# Altium project RK3588.PrjPcb (part 3 of 3)

## Sheet 20.BTB.SchDoc
size A3; SheetNumber: 20; SheetTotal: 21
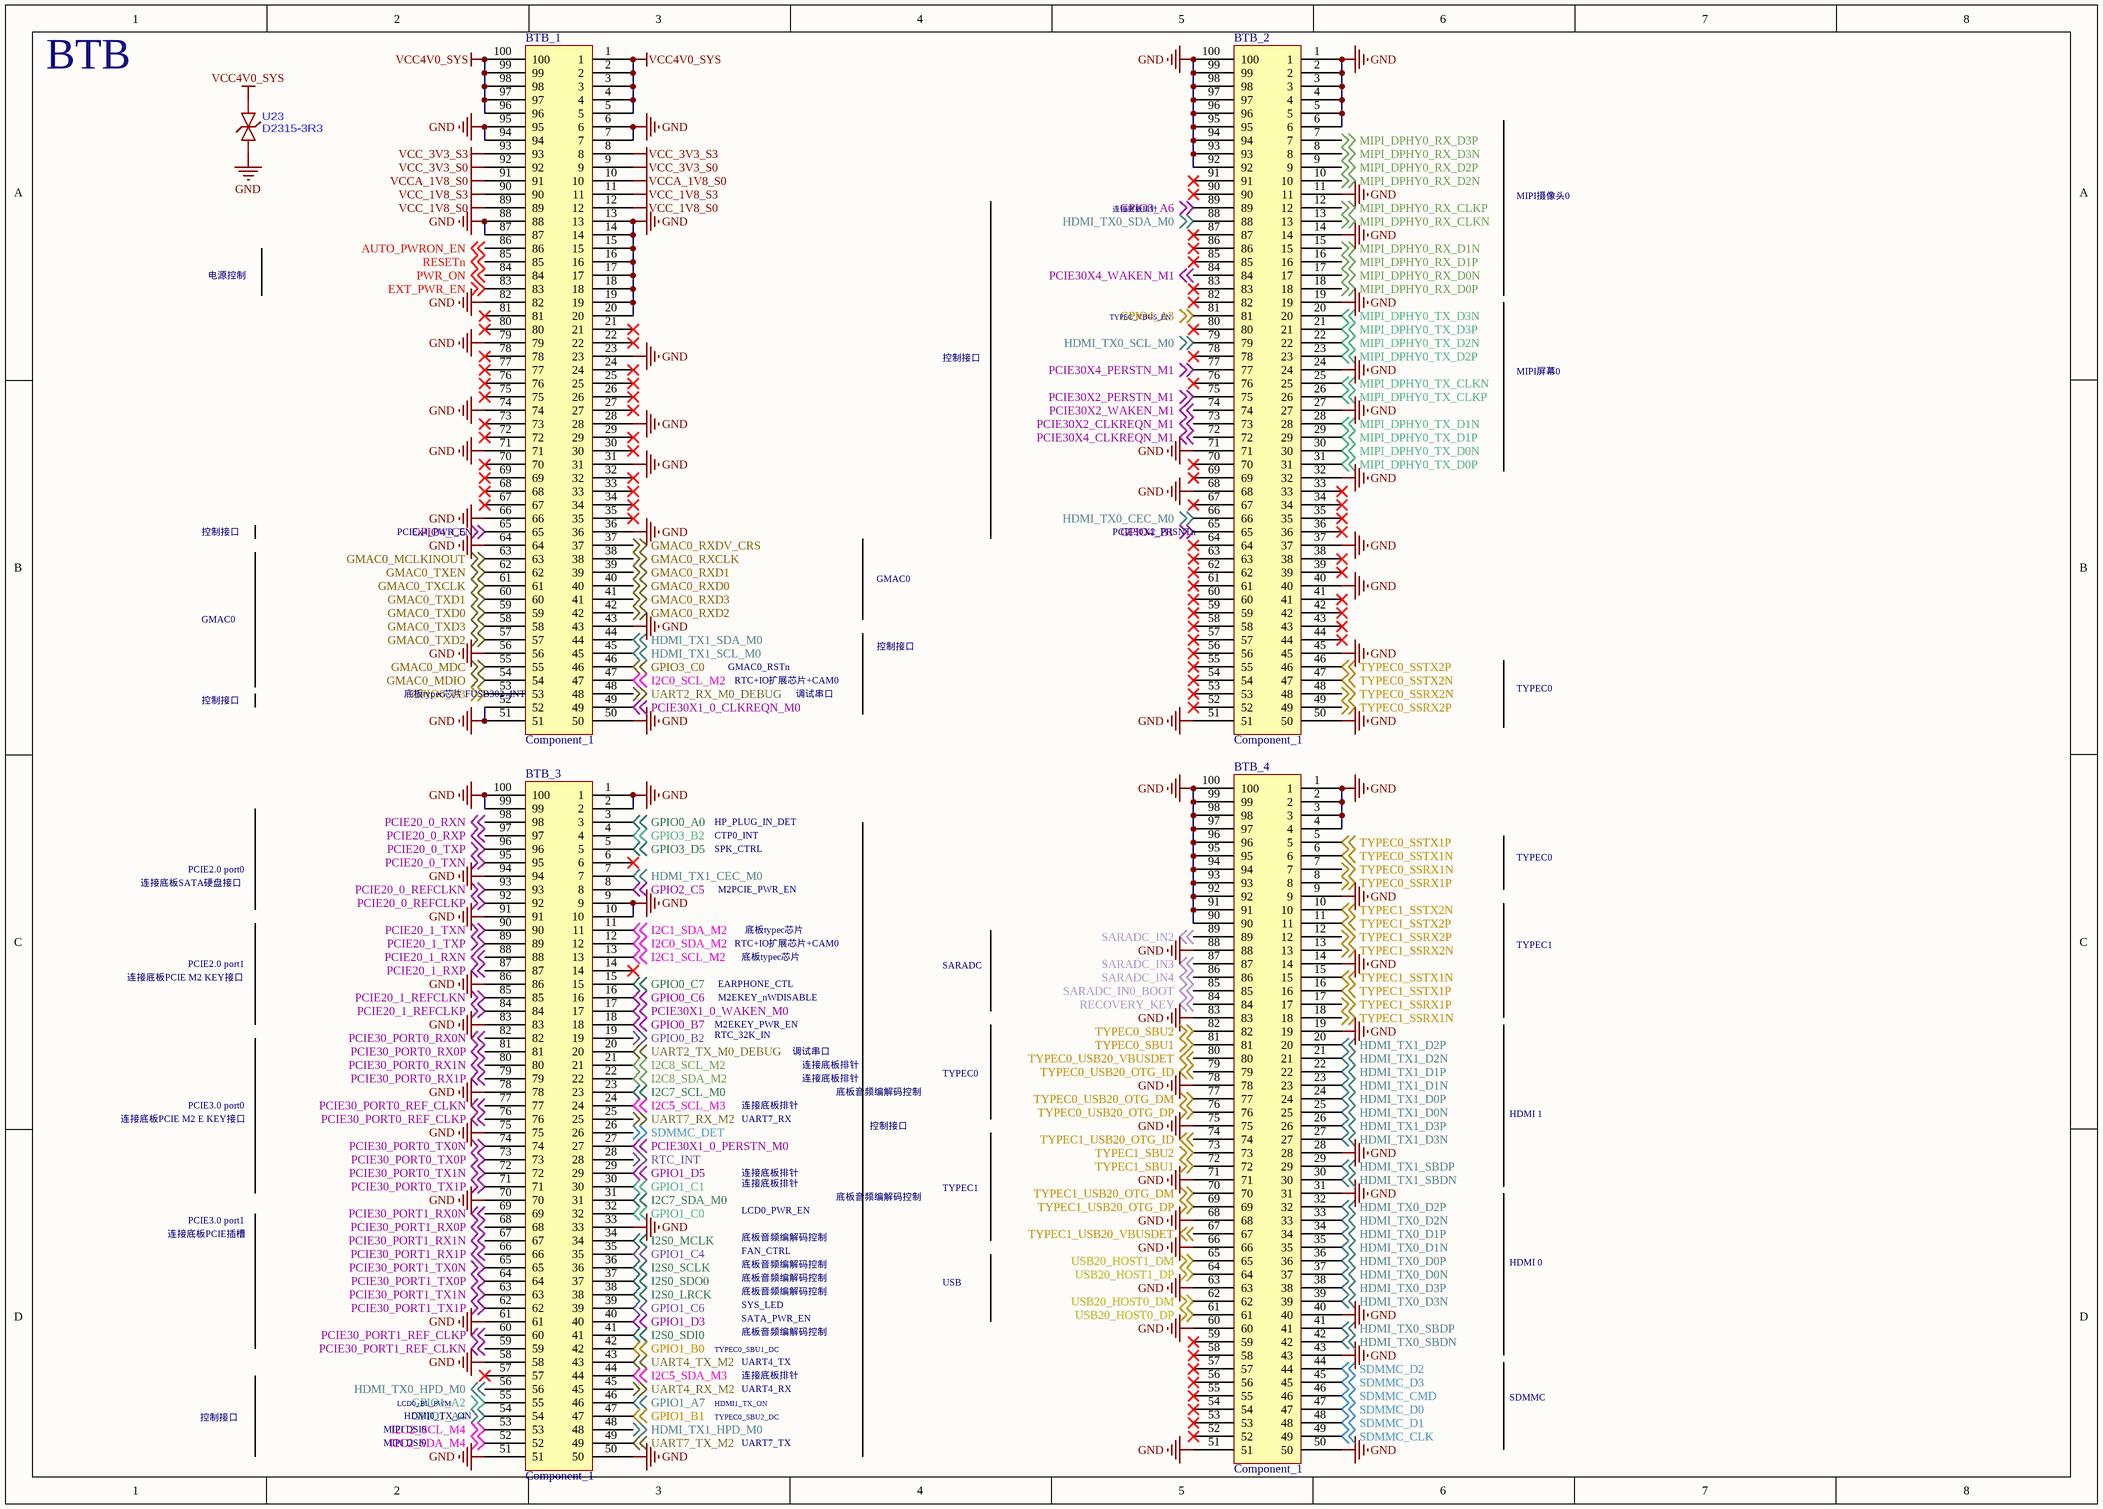
[diagram p19: 20.BTB.SchDoc]

### Parts
BTB_1  Component_1  [F_100PIN]
BTB_2  Component_1  [F_100PIN]
BTB_3  Component_1  [F_100PIN]
BTB_4  Component_1  [F_100PIN]
U23  D2315-3R3  [DFN1006-2L-BI]

### Nets
GND: BTB_1.6 BTB_1.7 BTB_1.13 BTB_1.14 BTB_1.15 BTB_1.16 BTB_1.17 BTB_1.18 BTB_1.19 BTB_1.20 BTB_1.23 BTB_1.28 BTB_1.31 BTB_1.36 BTB_1.43 BTB_1.50 BTB_1.51 BTB_1.52 BTB_1.56 BTB_1.64 BTB_1.66 BTB_1.71 BTB_1.74 BTB_1.79 BTB_1.82 BTB_1.87 BTB_1.88 BTB_1.94 BTB_1.95 BTB_2.1 BTB_2.2 BTB_2.3 BTB_2.4 BTB_2.5 BTB_2.6 BTB_2.11 BTB_2.14 BTB_2.19 BTB_2.24 BTB_2.27 BTB_2.32 BTB_2.37 BTB_2.40 BTB_2.45 BTB_2.50 BTB_2.51 BTB_2.68 BTB_2.71 BTB_2.92 BTB_2.93 BTB_2.94 BTB_2.95 BTB_2.96 BTB_2.97 BTB_2.98 BTB_2.99 BTB_2.100 BTB_3.1 BTB_3.2 BTB_3.9 BTB_3.10 BTB_3.33 BTB_3.50 BTB_3.51 BTB_3.58 BTB_3.61 BTB_3.70 BTB_3.75 BTB_3.78 BTB_3.83 BTB_3.86 BTB_3.91 BTB_3.94 BTB_3.99 BTB_3.100 BTB_4.1 BTB_4.2 BTB_4.3 BTB_4.4 BTB_4.9 BTB_4.14 BTB_4.19 BTB_4.28 BTB_4.31 BTB_4.40 BTB_4.43 BTB_4.50 BTB_4.51 BTB_4.60 BTB_4.63 BTB_4.66 BTB_4.68 BTB_4.71 BTB_4.75 BTB_4.78 BTB_4.83 BTB_4.88 BTB_4.90 BTB_4.91 BTB_4.92 BTB_4.93 BTB_4.94 BTB_4.95 BTB_4.96 BTB_4.97 BTB_4.98 BTB_4.99 BTB_4.100 U23.1
VCC4V0_SYS: BTB_1.1 BTB_1.2 BTB_1.3 BTB_1.4 BTB_1.5 BTB_1.96 BTB_1.97 BTB_1.98 BTB_1.99 BTB_1.100 U23.2
VCC_1V8_S0: BTB_1.12 BTB_1.89
VCC_1V8_S3: BTB_1.11 BTB_1.90  [project net VCC1V8_PMU_DDR_S3]
VCC_3V3_S0: BTB_1.9 BTB_1.92
VCC_3V3_S3: BTB_1.8 BTB_1.93
VCCA_1V8_S0: BTB_1.10 BTB_1.91  [project net AVDD1V8_DDR_PLL_S0]
AUTO_PWRON_EN: BTB_1.86 ; off-sheet AUTO_PWRON_EN
EXT_PWR_EN: BTB_1.83 ; off-sheet EXT_PWR_EN
GMAC0_MCLKINOUT: BTB_1.63 ; off-sheet GMAC0_MCLKINOUT
GMAC0_MDC: BTB_1.55 ; off-sheet GMAC0_MDC
GMAC0_MDIO: BTB_1.54 ; off-sheet GMAC0_MDIO
GMAC0_RXCLK: BTB_1.38 ; off-sheet GMAC0_RXCLK
GMAC0_RXD0: BTB_1.40 ; off-sheet GMAC0_RXD0
GMAC0_RXD1: BTB_1.39 ; off-sheet GMAC0_RXD1
GMAC0_RXD2: BTB_1.42 ; off-sheet GMAC0_RXD2
GMAC0_RXD3: BTB_1.41 ; off-sheet GMAC0_RXD3
GMAC0_RXDV_CRS: BTB_1.37 ; off-sheet GMAC0_RXDV_CRS
GMAC0_TXCLK: BTB_1.61 ; off-sheet GMAC0_TXCLK
GMAC0_TXD0: BTB_1.59 ; off-sheet GMAC0_TXD0
GMAC0_TXD1: BTB_1.60 ; off-sheet GMAC0_TXD1
GMAC0_TXD2: BTB_1.57 ; off-sheet GMAC0_TXD2
GMAC0_TXD3: BTB_1.58 ; off-sheet GMAC0_TXD3
GMAC0_TXEN: BTB_1.62 ; off-sheet GMAC0_TXEN
GPIO0_A0: BTB_3.3 ; off-sheet GPIO0_A0
GPIO0_B2: BTB_3.19 ; off-sheet GPIO0_B2
GPIO0_B7: BTB_3.18 ; off-sheet GPIO0_B7
GPIO0_C6: BTB_3.16 ; off-sheet GPIO0_C6
GPIO0_C7: BTB_3.15 ; off-sheet GPIO0_C7
GPIO0_D3: BTB_1.53 ; off-sheet GPIO0_D3
GPIO1_A2: BTB_3.55 ; off-sheet GPIO1_A2
GPIO1_A4: BTB_3.54 ; off-sheet GPIO1_A4
GPIO1_A7: BTB_3.46 ; off-sheet GPIO1_A7
GPIO1_B0: BTB_3.42 ; off-sheet GPIO1_B0
GPIO1_B1: BTB_3.47 ; off-sheet GPIO1_B1
GPIO1_C0: BTB_3.32 ; off-sheet GPIO1_C0
GPIO1_C1: BTB_3.30 ; off-sheet GPIO1_C1
GPIO1_C4: BTB_3.35 ; off-sheet GPIO1_C4
GPIO1_C6: BTB_3.39 ; off-sheet GPIO1_C6
GPIO1_D3: BTB_3.40 ; off-sheet GPIO1_D3
GPIO1_D5: BTB_3.29 ; off-sheet GPIO1_D5
GPIO2_C5: BTB_3.8 ; off-sheet GPIO2_C5
GPIO3_A6: BTB_2.89 ; off-sheet GPIO3_A6
GPIO3_B2: BTB_3.4 ; off-sheet GPIO3_B2
GPIO3_C0: BTB_1.46 ; off-sheet GPIO3_C0
GPIO3_D5: BTB_3.5 ; off-sheet GPIO3_D5
GPIO4_A3: BTB_2.81 ; off-sheet GPIO4_A3
GPIO4_B1: BTB_2.65 ; off-sheet GPIO4_B1
GPIO4_C6: BTB_1.65 ; off-sheet GPIO4_C6
HDMI_TX0_CEC_M0: BTB_2.66 ; off-sheet HDMI_TX0_CEC_M0
HDMI_TX0_D0N: BTB_4.37 ; off-sheet HDMI_TX0_D0N
HDMI_TX0_D0P: BTB_4.36 ; off-sheet HDMI_TX0_D0P
HDMI_TX0_D1N: BTB_4.35 ; off-sheet HDMI_TX0_D1N
HDMI_TX0_D1P: BTB_4.34 ; off-sheet HDMI_TX0_D1P
HDMI_TX0_D2N: BTB_4.33 ; off-sheet HDMI_TX0_D2N
HDMI_TX0_D2P: BTB_4.32 ; off-sheet HDMI_TX0_D2P
HDMI_TX0_D3N: BTB_4.39 ; off-sheet HDMI_TX0_D3N
HDMI_TX0_D3P: BTB_4.38 ; off-sheet HDMI_TX0_D3P
HDMI_TX0_HPD_M0: BTB_3.56 ; off-sheet HDMI_TX0_HPD_M0
HDMI_TX0_SBDN: BTB_4.42 ; off-sheet HDMI_TX0_SBDN
HDMI_TX0_SBDP: BTB_4.41 ; off-sheet HDMI_TX0_SBDP
HDMI_TX0_SCL_M0: BTB_2.79 ; off-sheet HDMI_TX0_SCL_M0
HDMI_TX0_SDA_M0: BTB_2.88 ; off-sheet HDMI_TX0_SDA_M0
HDMI_TX1_CEC_M0: BTB_3.7 ; off-sheet HDMI_TX1_CEC_M0
HDMI_TX1_D0N: BTB_4.25 ; off-sheet HDMI_TX1_D0N
HDMI_TX1_D0P: BTB_4.24 ; off-sheet HDMI_TX1_D0P
HDMI_TX1_D1N: BTB_4.23 ; off-sheet HDMI_TX1_D1N
HDMI_TX1_D1P: BTB_4.22 ; off-sheet HDMI_TX1_D1P
HDMI_TX1_D2N: BTB_4.21 ; off-sheet HDMI_TX1_D2N
HDMI_TX1_D2P: BTB_4.20 ; off-sheet HDMI_TX1_D2P
HDMI_TX1_D3N: BTB_4.27 ; off-sheet HDMI_TX1_D3N
HDMI_TX1_D3P: BTB_4.26 ; off-sheet HDMI_TX1_D3P
HDMI_TX1_HPD_M0: BTB_3.48 ; off-sheet HDMI_TX1_HPD_M0
HDMI_TX1_SBDN: BTB_4.30 ; off-sheet HDMI_TX1_SBDN
HDMI_TX1_SBDP: BTB_4.29 ; off-sheet HDMI_TX1_SBDP
HDMI_TX1_SCL_M0: BTB_1.45 ; off-sheet HDMI_TX1_SCL_M0
HDMI_TX1_SDA_M0: BTB_1.44 ; off-sheet HDMI_TX1_SDA_M0
I2C0_SCL_M2: BTB_1.47 ; off-sheet I2C0_SCL_M2
I2C0_SDA_M2: BTB_3.12 ; off-sheet I2C0_SDA_M2
I2C1_SCL_M2: BTB_3.13 ; off-sheet I2C1_SCL_M2
I2C1_SDA_M2: BTB_3.11 ; off-sheet I2C1_SDA_M2
I2C2_SCL_M4: BTB_3.53 ; off-sheet I2C2_SCL_M4
I2C2_SDA_M4: BTB_3.52 ; off-sheet I2C2_SDA_M4
I2C5_SCL_M3: BTB_3.24 ; off-sheet I2C5_SCL_M3
I2C5_SDA_M3: BTB_3.44 ; off-sheet I2C5_SDA_M3
I2C7_SCL_M0: BTB_3.23 ; off-sheet I2C7_SCL_M0
I2C7_SDA_M0: BTB_3.31 ; off-sheet I2C7_SDA_M0
I2C8_SCL_M2: BTB_3.21 ; off-sheet I2C8_SCL_M2
I2C8_SDA_M2: BTB_3.22 ; off-sheet I2C8_SDA_M2
I2S0_LRCK: BTB_3.38 ; off-sheet I2S0_LRCK
I2S0_MCLK: BTB_3.34 ; off-sheet I2S0_MCLK
I2S0_SCLK: BTB_3.36 ; off-sheet I2S0_SCLK
I2S0_SDI0: BTB_3.41 ; off-sheet I2S0_SDI0
I2S0_SDO0: BTB_3.37 ; off-sheet I2S0_SDO0
MIPI_DPHY0_RX_CLKN: BTB_2.13 ; off-sheet MIPI_DPHY0_RX_CLKN
MIPI_DPHY0_RX_CLKP: BTB_2.12 ; off-sheet MIPI_DPHY0_RX_CLKP
MIPI_DPHY0_RX_D0N: BTB_2.17 ; off-sheet MIPI_DPHY0_RX_D0N
MIPI_DPHY0_RX_D0P: BTB_2.18 ; off-sheet MIPI_DPHY0_RX_D0P
MIPI_DPHY0_RX_D1N: BTB_2.15 ; off-sheet MIPI_DPHY0_RX_D1N
MIPI_DPHY0_RX_D1P: BTB_2.16 ; off-sheet MIPI_DPHY0_RX_D1P
MIPI_DPHY0_RX_D2N: BTB_2.10 ; off-sheet MIPI_DPHY0_RX_D2N
MIPI_DPHY0_RX_D2P: BTB_2.9 ; off-sheet MIPI_DPHY0_RX_D2P
MIPI_DPHY0_RX_D3N: BTB_2.8 ; off-sheet MIPI_DPHY0_RX_D3N
MIPI_DPHY0_RX_D3P: BTB_2.7 ; off-sheet MIPI_DPHY0_RX_D3P
MIPI_DPHY0_TX_CLKN: BTB_2.25 ; off-sheet MIPI_DPHY0_TX_CLKN
MIPI_DPHY0_TX_CLKP: BTB_2.26 ; off-sheet MIPI_DPHY0_TX_CLKP
MIPI_DPHY0_TX_D0N: BTB_2.30 ; off-sheet MIPI_DPHY0_TX_D0N
MIPI_DPHY0_TX_D0P: BTB_2.31 ; off-sheet MIPI_DPHY0_TX_D0P
MIPI_DPHY0_TX_D1N: BTB_2.28 ; off-sheet MIPI_DPHY0_TX_D1N
MIPI_DPHY0_TX_D1P: BTB_2.29 ; off-sheet MIPI_DPHY0_TX_D1P
MIPI_DPHY0_TX_D2N: BTB_2.22 ; off-sheet MIPI_DPHY0_TX_D2N
MIPI_DPHY0_TX_D2P: BTB_2.23 ; off-sheet MIPI_DPHY0_TX_D2P
MIPI_DPHY0_TX_D3N: BTB_2.20 ; off-sheet MIPI_DPHY0_TX_D3N
MIPI_DPHY0_TX_D3P: BTB_2.21 ; off-sheet MIPI_DPHY0_TX_D3P
PCIE20_0_REFCLKN: BTB_3.93 ; off-sheet PCIE20_0_REFCLKN
PCIE20_0_REFCLKP: BTB_3.92 ; off-sheet PCIE20_0_REFCLKP
PCIE20_0_RXN: BTB_3.98 ; off-sheet PCIE20_0_RXN
PCIE20_0_RXP: BTB_3.97 ; off-sheet PCIE20_0_RXP
PCIE20_0_TXN: BTB_3.95 ; off-sheet PCIE20_0_TXN
PCIE20_0_TXP: BTB_3.96 ; off-sheet PCIE20_0_TXP
PCIE20_1_REFCLKN: BTB_3.85 ; off-sheet PCIE20_1_REFCLKN
PCIE20_1_REFCLKP: BTB_3.84 ; off-sheet PCIE20_1_REFCLKP
PCIE20_1_RXN: BTB_3.88 ; off-sheet PCIE20_1_RXN
PCIE20_1_RXP: BTB_3.87 ; off-sheet PCIE20_1_RXP
PCIE20_1_TXN: BTB_3.90 ; off-sheet PCIE20_1_TXN
PCIE20_1_TXP: BTB_3.89 ; off-sheet PCIE20_1_TXP
PCIE30_PORT0_REF_CLKN: BTB_3.77 ; off-sheet PCIE30_PORT0_REF_CLKN
PCIE30_PORT0_REF_CLKP: BTB_3.76 ; off-sheet PCIE30_PORT0_REF_CLKP
PCIE30_PORT0_RX0N: BTB_3.82 ; off-sheet PCIE30_PORT0_RX0N
PCIE30_PORT0_RX0P: BTB_3.81 ; off-sheet PCIE30_PORT0_RX0P
PCIE30_PORT0_RX1N: BTB_3.80 ; off-sheet PCIE30_PORT0_RX1N
PCIE30_PORT0_RX1P: BTB_3.79 ; off-sheet PCIE30_PORT0_RX1P
PCIE30_PORT0_TX0N: BTB_3.74 ; off-sheet PCIE30_PORT0_TX0N
PCIE30_PORT0_TX0P: BTB_3.73 ; off-sheet PCIE30_PORT0_TX0P
PCIE30_PORT0_TX1N: BTB_3.72 ; off-sheet PCIE30_PORT0_TX1N
PCIE30_PORT0_TX1P: BTB_3.71 ; off-sheet PCIE30_PORT0_TX1P
PCIE30_PORT1_REF_CLKN: BTB_3.59 ; off-sheet PCIE30_PORT1_REF_CLKN
PCIE30_PORT1_REF_CLKP: BTB_3.60 ; off-sheet PCIE30_PORT1_REF_CLKP
PCIE30_PORT1_RX0N: BTB_3.69 ; off-sheet PCIE30_PORT1_RX0N
PCIE30_PORT1_RX0P: BTB_3.68 ; off-sheet PCIE30_PORT1_RX0P
PCIE30_PORT1_RX1N: BTB_3.67 ; off-sheet PCIE30_PORT1_RX1N
PCIE30_PORT1_RX1P: BTB_3.66 ; off-sheet PCIE30_PORT1_RX1P
PCIE30_PORT1_TX0N: BTB_3.65 ; off-sheet PCIE30_PORT1_TX0N
PCIE30_PORT1_TX0P: BTB_3.64 ; off-sheet PCIE30_PORT1_TX0P
PCIE30_PORT1_TX1N: BTB_3.63 ; off-sheet PCIE30_PORT1_TX1N
PCIE30_PORT1_TX1P: BTB_3.62 ; off-sheet PCIE30_PORT1_TX1P
PCIE30X1_0_CLKREQN_M0: BTB_1.49 ; off-sheet PCIE30X1_0_CLKREQN_M0
PCIE30X1_0_PERSTN_M0: BTB_3.27 ; off-sheet PCIE30X1_0_PERSTN_M0
PCIE30X1_0_WAKEN_M0: BTB_3.17 ; off-sheet PCIE30X1_0_WAKEN_M0
PCIE30X2_CLKREQN_M1: BTB_2.73 ; off-sheet PCIE30X2_CLKREQN_M1
PCIE30X2_PERSTN_M1: BTB_2.75 ; off-sheet PCIE30X2_PERSTN_M1
PCIE30X2_WAKEN_M1: BTB_2.74 ; off-sheet PCIE30X2_WAKEN_M1
PCIE30X4_CLKREQN_M1: BTB_2.72 ; off-sheet PCIE30X4_CLKREQN_M1
PCIE30X4_PERSTN_M1: BTB_2.77 ; off-sheet PCIE30X4_PERSTN_M1
PCIE30X4_WAKEN_M1: BTB_2.84 ; off-sheet PCIE30X4_WAKEN_M1
PWR_ON: BTB_1.84 ; off-sheet PWR_ON
RECOVERY_KEY: BTB_4.84 ; off-sheet RECOVERY_KEY
RESETn: BTB_1.85 ; off-sheet RESETn
RTC_INT: BTB_3.28 ; off-sheet RTC_INT
SARADC_IN0_BOOT: BTB_4.85 ; off-sheet SARADC_IN0_BOOT
SARADC_IN2: BTB_4.89 ; off-sheet SARADC_IN2
SARADC_IN3: BTB_4.87 ; off-sheet SARADC_IN3
SARADC_IN4: BTB_4.86 ; off-sheet SARADC_IN4
SDMMC_CLK: BTB_4.49 ; off-sheet SDMMC_CLK
SDMMC_CMD: BTB_4.46 ; off-sheet SDMMC_CMD
SDMMC_D0: BTB_4.47 ; off-sheet SDMMC_D0
SDMMC_D1: BTB_4.48 ; off-sheet SDMMC_D1
SDMMC_D2: BTB_4.44 ; off-sheet SDMMC_D2
SDMMC_D3: BTB_4.45 ; off-sheet SDMMC_D3
SDMMC_DET: BTB_3.26 ; off-sheet SDMMC_DET
TYPEC0_SBU1: BTB_4.81 ; off-sheet TYPEC0_SBU1
TYPEC0_SBU2: BTB_4.82 ; off-sheet TYPEC0_SBU2
TYPEC0_SSRX1N: BTB_4.7 ; off-sheet TYPEC0_SSRX1N
TYPEC0_SSRX1P: BTB_4.8 ; off-sheet TYPEC0_SSRX1P
TYPEC0_SSRX2N: BTB_2.48 ; off-sheet TYPEC0_SSRX2N
TYPEC0_SSRX2P: BTB_2.49 ; off-sheet TYPEC0_SSRX2P
TYPEC0_SSTX1N: BTB_4.6 ; off-sheet TYPEC0_SSTX1N
TYPEC0_SSTX1P: BTB_4.5 ; off-sheet TYPEC0_SSTX1P
TYPEC0_SSTX2N: BTB_2.47 ; off-sheet TYPEC0_SSTX2N
TYPEC0_SSTX2P: BTB_2.46 ; off-sheet TYPEC0_SSTX2P
TYPEC0_USB20_OTG_DM: BTB_4.77 ; off-sheet TYPEC0_USB20_OTG_DM
TYPEC0_USB20_OTG_DP: BTB_4.76 ; off-sheet TYPEC0_USB20_OTG_DP
TYPEC0_USB20_OTG_ID: BTB_4.79 ; off-sheet TYPEC0_USB20_OTG_ID
TYPEC0_USB20_VBUSDET: BTB_4.80 ; off-sheet TYPEC0_USB20_VBUSDET
TYPEC1_SBU1: BTB_4.72 ; off-sheet TYPEC1_SBU1
TYPEC1_SBU2: BTB_4.73 ; off-sheet TYPEC1_SBU2
TYPEC1_SSRX1N: BTB_4.18 ; off-sheet TYPEC1_SSRX1N
TYPEC1_SSRX1P: BTB_4.17 ; off-sheet TYPEC1_SSRX1P
TYPEC1_SSRX2N: BTB_4.13 ; off-sheet TYPEC1_SSRX2N
TYPEC1_SSRX2P: BTB_4.12 ; off-sheet TYPEC1_SSRX2P
TYPEC1_SSTX1N: BTB_4.15 ; off-sheet TYPEC1_SSTX1N
TYPEC1_SSTX1P: BTB_4.16 ; off-sheet TYPEC1_SSTX1P
TYPEC1_SSTX2N: BTB_4.10 ; off-sheet TYPEC1_SSTX2N
TYPEC1_SSTX2P: BTB_4.11 ; off-sheet TYPEC1_SSTX2P
TYPEC1_USB20_OTG_DM: BTB_4.70 ; off-sheet TYPEC1_USB20_OTG_DM
TYPEC1_USB20_OTG_DP: BTB_4.69 ; off-sheet TYPEC1_USB20_OTG_DP
TYPEC1_USB20_OTG_ID: BTB_4.74 ; off-sheet TYPEC1_USB20_OTG_ID
TYPEC1_USB20_VBUSDET: BTB_4.67 ; off-sheet TYPEC1_USB20_VBUSDET
UART2_RX_M0_DEBUG: BTB_1.48 ; off-sheet UART2_RX_M0_DEBUG
UART2_TX_M0_DEBUG: BTB_3.20 ; off-sheet UART2_TX_M0_DEBUG
UART4_RX_M2: BTB_3.45 ; off-sheet UART4_RX_M2
UART4_TX_M2: BTB_3.43 ; off-sheet UART4_TX_M2
UART7_RX_M2: BTB_3.25 ; off-sheet UART7_RX_M2
UART7_TX_M2: BTB_3.49 ; off-sheet UART7_TX_M2
USB20_HOST0_DM: BTB_4.62 ; off-sheet USB20_HOST0_DM
USB20_HOST0_DP: BTB_4.61 ; off-sheet USB20_HOST0_DP
USB20_HOST1_DM: BTB_4.65 ; off-sheet USB20_HOST1_DM
USB20_HOST1_DP: BTB_4.64 ; off-sheet USB20_HOST1_DP

Not connected (* = marked no-connect by the designer): BTB_1 21* 22* 24* 25* 26* 27* 29* 30* 32* 33* 34* 35* 67* 68* 69* 70* 72* 73* 75* 76* 77* 78* 80* 81*; BTB_2 33* 34* 35* 36* 38* 39* 41* 42* 43* 44* 52* 53* 54* 55* 56* 57* 58* 59* 60* 61* 62* 63* 64* 67* 69* 70* 76* 78* 80* 82* 83* 85* 86* 87* 90* 91*; BTB_3 6* 14* 57*; BTB_4 52* 53* 54* 55* 56* 57* 58* 59*

### Notes on the sheet
- BTB
- 连接底板排针
- MIPI摄像头0
- 电源控制
- TYPEC_VBUS_EN
- 控制接口
- MIPI屏幕0
- PCIEx4_PWR_EN
- GMAC0
- PCIE30X2_PRSNTn
- 底板typec芯片 FUSB302_INT
- GMAC0_RSTn
- RTC+IO扩展芯片+CAM0
- 调试串口
- TYPEC0
- CTP0_INT
- SPK_CTRL
- HP_PLUG_IN_DET
- 连接底板SATA硬盘接口
- PCIE2.0 port0
- M2PCIE_PWR_EN
- 连接底板PCIE M2 KEY接口
- PCIE2.0 port1
- EARPHONE_CTL
- 底板typec芯片
- SARADC
- TYPEC1
- M2EKEY_PWR_EN
- RTC_32K_IN
- M2EKEY_nWDISABLE
- 连接底板PCIE M2 E KEY接口
- PCIE3.0 port0
- UART7_RX
- 底板音频编解码控制
- HDMI 1
- 连接底板PCIE插槽
- PCIE3.0 port1
- LCD0_PWR_EN
- FAN_CTRL
- SYS_LED
- SATA_PWR_EN
- USB
- HDMI 0
- TYPEC0_SBU1_DC
- UART4_RX
- UART4_TX
- MIPI DSI0
- LCD0_BL_PWM
- HDMI0_TX_ON
- HDMI1_TX_ON
- TYPEC0_SBU2_DC
- UART7_TX
- SDMMC

### Library data of the parts
BTB_1-BTB_4 = Component_1_1

## Sheet 21.RK3588_CONFIG.SchDoc
size A4; SheetNumber: 21; SheetTotal: 21
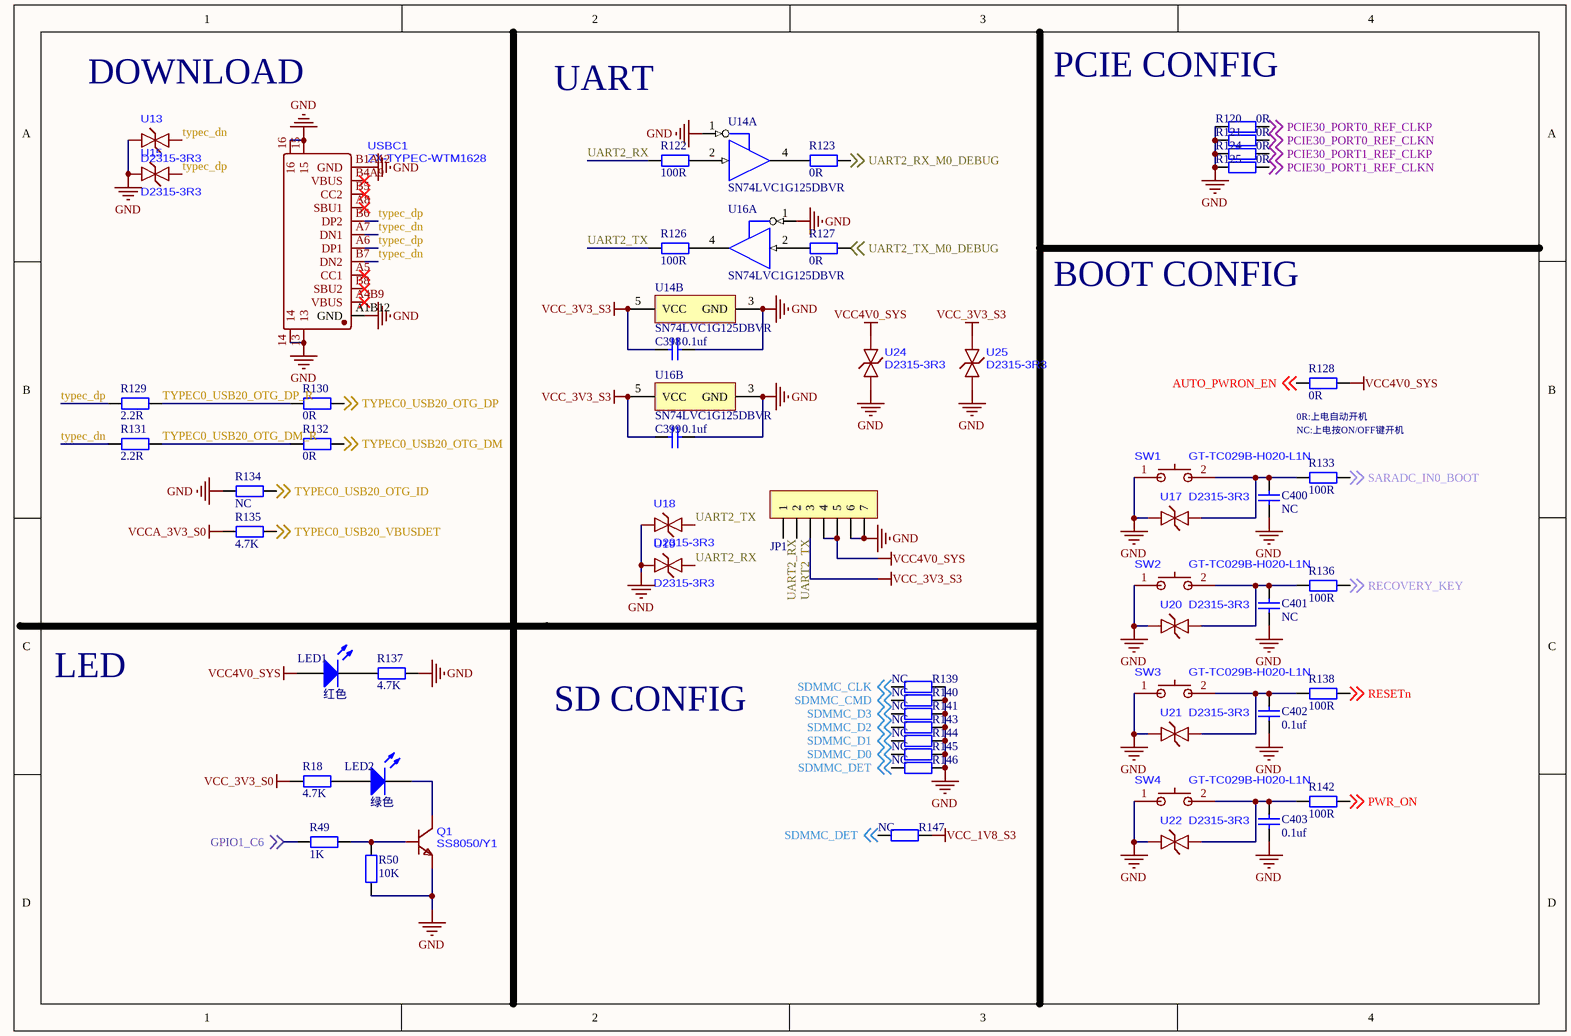
[diagram p20: 21.RK3588_CONFIG.SchDoc]

### Parts
C398  0.1uf  [C0402_L]
C399  0.1uf  [C0402_L]
C400  NC  [C0402_L]
C401  NC  [C0402_L]
C402  0.1uf  [C0402_L]
C403  0.1uf  [C0402_L]
JP1  CON-6P  [SH1.0-WT-7P]  (value not drawn)
LED1  红色  [LED0603_R]
LED2  绿色  [LED0603_R]
Q1  SS8050/Y1  [SOT-23-3_L2.9-W1.3-P1.90-LS2.4-TL]
R18  4.7K  [R0402_L]
R49  1K  [R0402_L]
R50  10K  [R0402_L]
R120  0R  [R0402_L]
R121  0R  [R0402_L]
R122  100R  [R0402_L]
R123  0R  [R0402_L]
R124  0R  [R0402_L]
R125  0R  [R0402_L]
R126  100R  [R0402_L]
R127  0R  [R0402_L]
R128  0R  [R0402_L]
R129  2.2R  [R0402_L]
R130  0R  [R0402_L]
R131  2.2R  [R0402_L]
R132  0R  [R0402_L]
R133  100R  [R0402_L]
R134  NC  [R0402_L]
R135  4.7K  [R0402_L]
R136  100R  [R0402_L]
R137  4.7K  [R0402_L]
R138  100R  [R0402_L]
R139  NC  [R0402_L]
R140  NC  [R0402_L]
R141  NC  [R0402_L]
R142  100R  [R0402_L]
R143  NC  [R0402_L]
R144  NC  [R0402_L]
R145  NC  [R0402_L]
R146  NC  [R0402_L]
R147  NC  [R0402_L]
SW1  GT-TC029B-H020-L1N  [SW-SMD_L3.9-W2.9-P4.15-LS5.0]
SW2  GT-TC029B-H020-L1N  [SW-SMD_L3.9-W2.9-P4.15-LS5.0]
SW3  GT-TC029B-H020-L1N  [SW-SMD_L3.9-W2.9-P4.15-LS5.0]
SW4  GT-TC029B-H020-L1N  [SW-SMD_L3.9-W2.9-P4.15-LS5.0]
U13  D2315-3R3  [DFN1006-2L-BI]
U14  SN74LVC1G125DBVR  [SOT23-5]  (parts A,B of 2)
U15  D2315-3R3  [DFN1006-2L-BI]
U16  SN74LVC1G125DBVR  [SOT23-5]  (parts A,B of 2)
U17  D2315-3R3  [DFN1006-2L-BI]
U18  D2315-3R3  [DFN1006-2L-BI]
U19  D2315-3R3  [DFN1006-2L-BI]
U20  D2315-3R3  [DFN1006-2L-BI]
U21  D2315-3R3  [DFN1006-2L-BI]
U22  D2315-3R3  [DFN1006-2L-BI]
U24  D2315-3R3  [DFN1006-2L-BI]
U25  D2315-3R3  [DFN1006-2L-BI]
USBC1  ZX-TYPEC-WTM1628  [USB-C-SMD_ZX-TYPEC-WTM1628]

### Nets
GND: C398.2 C399.2 C400.1 C401.1 C402.1 C403.1 JP1.6 JP1.7 Q1.2(E) R50.1 R120.1 R121.1 R124.1 R125.1 R134.1 R137.2 R139.2 R140.2 R141.2 R143.2 R144.2 R145.2 R146.2 SW1.1 SW2.1 SW3.1 SW4.1 U13.1 U14.1(~{OE}) U14.3(GND) U15.1 U16.1(~{OE}) U16.3(GND) U17.1 U18.1 U19.1 U20.1 U21.1 U22.1 U24.1 U25.1 USBC1.13 USBC1.14 USBC1.15 USBC1.16 USBC1.A1B12(GND) USBC1.B1A12(GND)
VCC4V0_SYS: JP1.4 JP1.5 LED1.1(A) R128.2 U24.2
VCC_1V8_S3: R147.2  [project net VCC1V8_PMU_DDR_S3]
VCC_3V3_S0: R18.1
VCC_3V3_S3: C398.1 C399.1 JP1.3 U14.5(VCC) U16.5(VCC) U25.2
VCCA_3V3_S0: R135.1
AUTO_PWRON_EN: R128.1 ; off-sheet AUTO_PWRON_EN
GPIO1_C6: R49.1 ; off-sheet GPIO1_C6
PCIE30_PORT0_REF_CLKN: R121.2 ; off-sheet PCIE30_PORT0_REF_CLKN
PCIE30_PORT0_REF_CLKP: R120.2 ; off-sheet PCIE30_PORT0_REF_CLKP
PCIE30_PORT1_REF_CLKN: R125.2 ; off-sheet PCIE30_PORT1_REF_CLKN
PCIE30_PORT1_REF_CLKP: R124.2 ; off-sheet PCIE30_PORT1_REF_CLKP
PWR_ON: R142.2 ; off-sheet PWR_ON
RECOVERY_KEY: R136.2 ; off-sheet RECOVERY_KEY
RESETn: R138.2 ; off-sheet RESETn
SARADC_IN0_BOOT: R133.2 ; off-sheet SARADC_IN0_BOOT
SDMMC_CLK: R139.1 ; off-sheet SDMMC_CLK
SDMMC_CMD: R140.1 ; off-sheet SDMMC_CMD
SDMMC_D0: R145.1 ; off-sheet SDMMC_D0
SDMMC_D1: R144.1 ; off-sheet SDMMC_D1
SDMMC_D2: R143.1 ; off-sheet SDMMC_D2
SDMMC_D3: R141.1 ; off-sheet SDMMC_D3
SDMMC_DET: R146.1 R147.1 ; off-sheet SDMMC_DET
TYPEC0_USB20_OTG_DM: R132.2 ; off-sheet TYPEC0_USB20_OTG_DM
TYPEC0_USB20_OTG_DM_R: R131.2 R132.1
TYPEC0_USB20_OTG_DP: R130.2 ; off-sheet TYPEC0_USB20_OTG_DP
TYPEC0_USB20_OTG_DP_R: R129.2 R130.1
TYPEC0_USB20_OTG_ID: R134.2 ; off-sheet TYPEC0_USB20_OTG_ID
TYPEC0_USB20_VBUSDET: R135.2 ; off-sheet TYPEC0_USB20_VBUSDET
typec_dn: R131.1 U13.2 USBC1.A7(DN1) USBC1.B7(DN2)
typec_dp: R129.1 U15.2 USBC1.A6(DP1) USBC1.B6(DP2)
UART2_RX: JP1.1 R122.1 U19.2
UART2_RX_M0_DEBUG: R123.2 ; off-sheet UART2_RX_M0_DEBUG
UART2_TX: JP1.2 R126.1 U18.2
UART2_TX_M0_DEBUG: R127.2 ; off-sheet UART2_TX_M0_DEBUG
NetC400_2: C400.2 R133.1 SW1.2 U17.2
NetC401_2: C401.2 R136.1 SW2.2 U20.2
NetC402_2: C402.2 R138.1 SW3.2 U21.2
NetC403_2: C403.2 R142.1 SW4.2 U22.2
NetLED1_2: LED1.2(K) R137.1
NetLED2_1: LED2.1(A) R18.2
NetLED2_2: LED2.2(K) Q1.3(C)
NetQ1_1: Q1.1(B) R49.2 R50.2
NetR122_2: R122.2 U14.2(A)
NetR123_1: R123.1 U14.4(Y)
NetR126_2: R126.2 U16.4(Y)
NetR127_1: R127.1 U16.2(A)

Not connected (* = marked no-connect by the designer): USBC1 A4B9(VBUS)* A5(CC1)* A8(SBU1)* B4A9(VBUS)* B5(CC2)* B8(SBU2)*

### Notes on the sheet
- (near U13) DOWNLOAD
- UART
- PCIE CONFIG
- BOOT CONFIG
- (near R128) 0R:上电自动开机
- NC:上电按ON/OFF键开机
- LED
- SD CONFIG

### Library data of the parts
C398-C403 = C: 贴片电容/MLCC电容
JP1 = Header 7: 7P连接器
LED1 LED2 = LED: 贴片LED
R18 R49 R50 R120-R147 = R: 贴片电阻
U14 U16 = SN74LVC1G125DBVR: 三态输出单路总线缓冲器闸

## Nets that join several sheets
AVDD1V8_DDR_PLL_S0: 1.PMIC_1 (C2.2 C48.1 U1.60), 5.RK3588_OSC_PLL_PMUIO1 (5 pins), 7.RK3588_DDR_Controler (C204.2 C211.2 U8.K16 U8.M12), 9.RK3588_USB_Controler (9 pins), 10.RK3588_VCCIO1_VCCIO3_SARADC (6 pins), 13.RK3588_PCIE2.0_PCIE3.0 (10 pins), 20.BTB (BTB_1.10 BTB_1.91)
GND: 1.PMIC_1 (69 pins), 2.PMIC_2 (55 pins), 3.RK3588_POWER (68 pins), 4.RK3588_GND (418 pins), 5.RK3588_OSC_PLL_PMUIO1 (15 pins), 6.RK3588_PMUIO2 (C183.1 C184.1 R40.1 R42.1), 7.RK3588_DDR_Controler (32 pins), 8.RK3588_EMMCIO_VCCIO2 (C215.1 C216.1 C217.1), 9.RK3588_USB_Controler (18 pins), 10.RK3588_VCCIO1_VCCIO3_SARADC (12 pins), 11.RK3588_MIPI_D_C_PHY0_1 (7 pins), 12.RK3588_MIPI_CSI_HDMI2.1_HDMI (22 pins), 13.RK3588_PCIE2.0_PCIE3.0 (16 pins), 14.RK3588_VCCIO4 (C291.1 C292.1), 15.RK3588_VCCIO5 (C293.1 C294.1), 16.RK3588_VCCIO6 (C295.1 C296.1), 17.LPDDR4_LPDDR4x_1 (102 pins), 18.LPDDR4_LPDDR4x_2 (102 pins), 19.EMMC_FLASH (27 pins), 20.BTB (109 pins), 21.RK3588_CONFIG (47 pins)
HDMI_VDDA0V85_S0: 1.PMIC_1 (C33.2 U1.11), 12.RK3588_MIPI_CSI_HDMI2.1_HDMI (11 pins)
VCC1V8_PMU_DDR_S3: 1.PMIC_1 (7 pins), 5.RK3588_OSC_PLL_PMUIO1 (C179.2 U8.N28), 6.RK3588_PMUIO2 (C183.2 U8.R27), 8.RK3588_EMMCIO_VCCIO2 (C215.2 U8.V26), 17.LPDDR4_LPDDR4x_1 (17 pins), 18.LPDDR4_LPDDR4x_2 (17 pins), 19.EMMC_FLASH (6 pins), 20.BTB (BTB_1.11 BTB_1.90), 21.RK3588_CONFIG (R147.2)
VCC4V0_SYS: 1.PMIC_1 (26 pins), 2.PMIC_2 (20 pins), 20.BTB (11 pins), 21.RK3588_CONFIG (5 pins)
VCC_1V1_NLDO_S3: 1.PMIC_1 (C31.2 C35.2 U1.9 U1.13), 2.PMIC_2 (5 pins)
VCC_1V8_S0: 1.PMIC_1 (C5.2 U1.58), 2.PMIC_2 (R21.1), 8.RK3588_EMMCIO_VCCIO2 (C216.2 U8.AA7), 10.RK3588_VCCIO1_VCCIO3_SARADC (C240.2 C241.2 U8.G20 U8.Y26), 11.RK3588_MIPI_D_C_PHY0_1 (C252.2 C253.2 U8.AJ20), 12.RK3588_MIPI_CSI_HDMI2.1_HDMI (10 pins), 14.RK3588_VCCIO4 (C291.2 U8.H20), 15.RK3588_VCCIO5 (C293.2 U8.W25), 16.RK3588_VCCIO6 (C295.2 U8.AC25), 20.BTB (BTB_1.12 BTB_1.89)
VCC_3V3_S0: 2.PMIC_2 (C77.2 C78.2 U4.1), 14.RK3588_VCCIO4 (C292.2 U8.H21), 15.RK3588_VCCIO5 (C294.2 U8.W26), 16.RK3588_VCCIO6 (C296.2 U8.AC26), 19.EMMC_FLASH (R104.1), 20.BTB (BTB_1.9 BTB_1.92), 21.RK3588_CONFIG (R18.1)
VCC_3V3_S3: 1.PMIC_1 (5 pins), 2.PMIC_2 (R19.2 U4.5), 6.RK3588_PMUIO2 (6 pins), 20.BTB (BTB_1.8 BTB_1.93), 21.RK3588_CONFIG (6 pins)
VCCA_3V3_S0: 1.PMIC_1 (C16.2 U1.63), 9.RK3588_USB_Controler (C225.2 U8.AJ10), 21.RK3588_CONFIG (R135.1)
VCCIO_SD_S0: 1.PMIC_1 (C18.2 U1.65), 8.RK3588_EMMCIO_VCCIO2 (C217.2 U8.Y7)
VDD2_DDR_S3: 1.PMIC_1 (7 pins), 7.RK3588_DDR_Controler (C192.2 C200.2 U8.H13 U8.N8), 17.LPDDR4_LPDDR4x_1 (41 pins), 18.LPDDR4_LPDDR4x_2 (41 pins)
VDD_0V75_S0: 1.PMIC_1 (C36.2 U1.8), 5.RK3588_OSC_PLL_PMUIO1 (C177.2 C178.2 U8.V20), 9.RK3588_USB_Controler (C222.2 U8.AH10), 10.RK3588_VCCIO1_VCCIO3_SARADC (C239.2 U8.AD3), 11.RK3588_MIPI_D_C_PHY0_1 (R65.2), 13.RK3588_PCIE2.0_PCIE3.0 (6 pins)
VDD_0V75_S3: 1.PMIC_1 (C21.2 U1.14), 5.RK3588_OSC_PLL_PMUIO1 (C181.2 C182.2 U8.P27)
VDD_CPU_BIG0_S0: 2.PMIC_2 (11 pins), 3.RK3588_POWER (23 pins)
VDD_CPU_BIG1_MEM_S0: 2.PMIC_2 (C88.2 FB1.2), 3.RK3588_POWER (C144.2 C145.2 U8.M21 U8.N21)
VDD_CPU_BIG1_S0: 2.PMIC_2 (12 pins), 3.RK3588_POWER (20 pins)
VDD_CPU_LIT_S0: 1.PMIC_1 (10 pins), 3.RK3588_POWER (19 pins)
VDD_DDR_S0: 1.PMIC_1 (9 pins), 7.RK3588_DDR_Controler (22 pins)
VDD_GPU_S0: 1.PMIC_1 (10 pins), 3.RK3588_POWER (24 pins)
VDD_LOGIC_S0: 1.PMIC_1 (10 pins), 3.RK3588_POWER (19 pins)
VDD_NPU_S0: 2.PMIC_2 (11 pins), 3.RK3588_POWER (18 pins)
VDD_VDENC_S0: 1.PMIC_1 (10 pins), 3.RK3588_POWER (16 pins)
VDDA_0V85_S0: 1.PMIC_1 (C34.2 U1.10), 9.RK3588_USB_Controler (8 pins), 11.RK3588_MIPI_D_C_PHY0_1 (R67.2), 13.RK3588_PCIE2.0_PCIE3.0 (C277.2 C283.2 U8.L28 U8.M28)
VDDA_1V2_S0: 1.PMIC_1 (C15.2 U1.57), 11.RK3588_MIPI_D_C_PHY0_1 (C248.2 C249.2 U8.AH20)
VDDA_DDR_PLL_S0: 1.PMIC_1 (C32.2 U1.12), 7.RK3588_DDR_Controler (C205.2 C212.2 U8.L15 U8.N12)
VDDQ_DDR: 1.PMIC_1 (7 pins), 7.RK3588_DDR_Controler (30 pins), 17.LPDDR4_LPDDR4x_1 (41 pins), 18.LPDDR4_LPDDR4x_2 (41 pins)
AUTO_PWRON_EN: 1.PMIC_1 (C70.2), 20.BTB (BTB_1.86), 21.RK3588_CONFIG (R128.1)
CPU_BIG0_VSEL: 2.PMIC_2 (U3.A1), 5.RK3588_OSC_PLL_PMUIO1 (U8.R31)
CPU_BIG1_VSEL: 2.PMIC_2 (U5.A1), 6.RK3588_PMUIO2 (U8.W28)
DDR_CH0_A0_A: 7.RK3588_DDR_Controler (U8.T7), 17.LPDDR4_LPDDR4x_1 (U9.H2)
DDR_CH0_A0_B: 7.RK3588_DDR_Controler (U8.M8), 17.LPDDR4_LPDDR4x_1 (U9.R2)
DDR_CH0_A1_A: 7.RK3588_DDR_Controler (U8.T8), 17.LPDDR4_LPDDR4x_1 (U9.J2)
DDR_CH0_A1_B: 7.RK3588_DDR_Controler (U8.M5), 17.LPDDR4_LPDDR4x_1 (U9.P2)
DDR_CH0_A2_A: 7.RK3588_DDR_Controler (U8.P4), 17.LPDDR4_LPDDR4x_1 (U9.H9)
DDR_CH0_A2_B: 7.RK3588_DDR_Controler (U8.N5), 17.LPDDR4_LPDDR4x_1 (U9.R9)
DDR_CH0_A3_A: 7.RK3588_DDR_Controler (U8.P5), 17.LPDDR4_LPDDR4x_1 (U9.H10)
DDR_CH0_A3_B: 7.RK3588_DDR_Controler (U8.N4), 17.LPDDR4_LPDDR4x_1 (U9.R10)
DDR_CH0_A4_A: 7.RK3588_DDR_Controler (U8.R1), 17.LPDDR4_LPDDR4x_1 (U9.H11)
DDR_CH0_A4_B: 7.RK3588_DDR_Controler (U8.K1), 17.LPDDR4_LPDDR4x_1 (U9.R11)
DDR_CH0_A5_A: 7.RK3588_DDR_Controler (U8.P2), 17.LPDDR4_LPDDR4x_1 (U9.J11)
DDR_CH0_A5_B: 7.RK3588_DDR_Controler (U8.L2), 17.LPDDR4_LPDDR4x_1 (U9.P11)
DDR_CH0_CLKN_A: 7.RK3588_DDR_Controler (U8.N1), 17.LPDDR4_LPDDR4x_1 (U9.J9)
DDR_CH0_CLKN_B: 7.RK3588_DDR_Controler (U8.M1), 17.LPDDR4_LPDDR4x_1 (U9.P9)
DDR_CH0_CLKP_A: 7.RK3588_DDR_Controler (U8.N2), 17.LPDDR4_LPDDR4x_1 (U9.J8)
DDR_CH0_CLKP_B: 7.RK3588_DDR_Controler (U8.M2), 17.LPDDR4_LPDDR4x_1 (U9.P8)
DDR_CH0_DM0_A: 7.RK3588_DDR_Controler (U8.Y4), 17.LPDDR4_LPDDR4x_1 (U9.C3)
DDR_CH0_DM0_B: 7.RK3588_DDR_Controler (U8.G4), 17.LPDDR4_LPDDR4x_1 (U9.Y3)
DDR_CH0_DM1_A: 7.RK3588_DDR_Controler (U8.AB4), 17.LPDDR4_LPDDR4x_1 (U9.C10)
DDR_CH0_DM1_B: 7.RK3588_DDR_Controler (U8.E4), 17.LPDDR4_LPDDR4x_1 (U9.Y10)
DDR_CH0_DQ0_A: 7.RK3588_DDR_Controler (U8.U1), 17.LPDDR4_LPDDR4x_1 (U9.B2)
DDR_CH0_DQ0_B: 7.RK3588_DDR_Controler (U8.H1), 17.LPDDR4_LPDDR4x_1 (U9.AA2)
DDR_CH0_DQ1_A: 7.RK3588_DDR_Controler (U8.T2), 17.LPDDR4_LPDDR4x_1 (U9.C2)
DDR_CH0_DQ1_B: 7.RK3588_DDR_Controler (U8.J2), 17.LPDDR4_LPDDR4x_1 (U9.Y2)
DDR_CH0_DQ2_A: 7.RK3588_DDR_Controler (U8.T1), 17.LPDDR4_LPDDR4x_1 (U9.E2)
DDR_CH0_DQ2_B: 7.RK3588_DDR_Controler (U8.J1), 17.LPDDR4_LPDDR4x_1 (U9.V2)
DDR_CH0_DQ3_A: 7.RK3588_DDR_Controler (U8.R2), 17.LPDDR4_LPDDR4x_1 (U9.F2)
DDR_CH0_DQ3_B: 7.RK3588_DDR_Controler (U8.K2), 17.LPDDR4_LPDDR4x_1 (U9.U2)
DDR_CH0_DQ4_A: 7.RK3588_DDR_Controler (U8.W1), 17.LPDDR4_LPDDR4x_1 (U9.F4)
DDR_CH0_DQ4_B: 7.RK3588_DDR_Controler (U8.F1), 17.LPDDR4_LPDDR4x_1 (U9.U4)
DDR_CH0_DQ5_A: 7.RK3588_DDR_Controler (U8.V2), 17.LPDDR4_LPDDR4x_1 (U9.E4)
DDR_CH0_DQ5_B: 7.RK3588_DDR_Controler (U8.G2), 17.LPDDR4_LPDDR4x_1 (U9.V4)
DDR_CH0_DQ6_A: 7.RK3588_DDR_Controler (U8.V1), 17.LPDDR4_LPDDR4x_1 (U9.C4)
DDR_CH0_DQ6_B: 7.RK3588_DDR_Controler (U8.G1), 17.LPDDR4_LPDDR4x_1 (U9.Y4)
DDR_CH0_DQ7_A: 7.RK3588_DDR_Controler (U8.U2), 17.LPDDR4_LPDDR4x_1 (U9.B4)
DDR_CH0_DQ7_B: 7.RK3588_DDR_Controler (U8.H2), 17.LPDDR4_LPDDR4x_1 (U9.AA4)
DDR_CH0_DQ8_A: 7.RK3588_DDR_Controler (U8.AB2), 17.LPDDR4_LPDDR4x_1 (U9.B11)
DDR_CH0_DQ8_B: 7.RK3588_DDR_Controler (U8.D2), 17.LPDDR4_LPDDR4x_1 (U9.AA11)
DDR_CH0_DQ9_A: 7.RK3588_DDR_Controler (U8.AB1), 17.LPDDR4_LPDDR4x_1 (U9.C11)
DDR_CH0_DQ9_B: 7.RK3588_DDR_Controler (U8.C1), 17.LPDDR4_LPDDR4x_1 (U9.Y11)
DDR_CH0_DQ10_A: 7.RK3588_DDR_Controler (U8.AC1), 17.LPDDR4_LPDDR4x_1 (U9.E11)
DDR_CH0_DQ10_B: 7.RK3588_DDR_Controler (U8.C2), 17.LPDDR4_LPDDR4x_1 (U9.V11)
DDR_CH0_DQ11_A: 7.RK3588_DDR_Controler (U8.AC2), 17.LPDDR4_LPDDR4x_1 (U9.F11)
DDR_CH0_DQ11_B: 7.RK3588_DDR_Controler (U8.B1), 17.LPDDR4_LPDDR4x_1 (U9.U11)
DDR_CH0_DQ12_A: 7.RK3588_DDR_Controler (U8.Y1), 17.LPDDR4_LPDDR4x_1 (U9.F9)
DDR_CH0_DQ12_B: 7.RK3588_DDR_Controler (U8.F2), 17.LPDDR4_LPDDR4x_1 (U9.U9)
DDR_CH0_DQ13_A: 7.RK3588_DDR_Controler (U8.Y2), 17.LPDDR4_LPDDR4x_1 (U9.E9)
DDR_CH0_DQ13_B: 7.RK3588_DDR_Controler (U8.E1), 17.LPDDR4_LPDDR4x_1 (U9.V9)
DDR_CH0_DQ14_A: 7.RK3588_DDR_Controler (U8.AA1), 17.LPDDR4_LPDDR4x_1 (U9.C9)
DDR_CH0_DQ14_B: 7.RK3588_DDR_Controler (U8.E2), 17.LPDDR4_LPDDR4x_1 (U9.Y9)
DDR_CH0_DQ15_A: 7.RK3588_DDR_Controler (U8.AA2), 17.LPDDR4_LPDDR4x_1 (U9.B9)
DDR_CH0_DQ15_B: 7.RK3588_DDR_Controler (U8.D1), 17.LPDDR4_LPDDR4x_1 (U9.AA9)
DDR_CH0_DQS0N_A: 7.RK3588_DDR_Controler (U8.U4), 17.LPDDR4_LPDDR4x_1 (U9.E3)
DDR_CH0_DQS0N_B: 7.RK3588_DDR_Controler (U8.J7), 17.LPDDR4_LPDDR4x_1 (U9.V3)
DDR_CH0_DQS0P_A: 7.RK3588_DDR_Controler (U8.U5), 17.LPDDR4_LPDDR4x_1 (U9.D3)
DDR_CH0_DQS0P_B: 7.RK3588_DDR_Controler (U8.J8), 17.LPDDR4_LPDDR4x_1 (U9.W3)
DDR_CH0_DQS1N_A: 7.RK3588_DDR_Controler (U8.AA4), 17.LPDDR4_LPDDR4x_1 (U9.E10)
DDR_CH0_DQS1N_B: 7.RK3588_DDR_Controler (U8.F4), 17.LPDDR4_LPDDR4x_1 (U9.V10)
DDR_CH0_DQS1P_A: 7.RK3588_DDR_Controler (U8.AA5), 17.LPDDR4_LPDDR4x_1 (U9.D10)
DDR_CH0_DQS1P_B: 7.RK3588_DDR_Controler (U8.F5), 17.LPDDR4_LPDDR4x_1 (U9.W10)
DDR_CH0_LP4/4X_CKE0_A: 7.RK3588_DDR_Controler (U8.P7), 17.LPDDR4_LPDDR4x_1 (R87.1)
DDR_CH0_LP4/4X_CKE0_B: 7.RK3588_DDR_Controler (U8.L5), 17.LPDDR4_LPDDR4x_1 (R88.1)
DDR_CH0_LP4/4X_CKE1_A: 7.RK3588_DDR_Controler (U8.N7), 17.LPDDR4_LPDDR4x_1 (R89.1)
DDR_CH0_LP4/4X_CKE1_B: 7.RK3588_DDR_Controler (U8.L4), 17.LPDDR4_LPDDR4x_1 (R90.1)
DDR_CH0_LP4/4X_CS0_A: 7.RK3588_DDR_Controler (U8.R6), 17.LPDDR4_LPDDR4x_1 (U9.H4)
DDR_CH0_LP4/4X_CS0_B: 7.RK3588_DDR_Controler (U8.L7), 17.LPDDR4_LPDDR4x_1 (U9.R4)
DDR_CH0_LP4/4X_CS1_A: 7.RK3588_DDR_Controler (U8.R7), 17.LPDDR4_LPDDR4x_1 (U9.H3)
DDR_CH0_LP4/4X_CS1_B: 7.RK3588_DDR_Controler (U8.L8), 17.LPDDR4_LPDDR4x_1 (U9.R3)
DDR_CH1_A0_C: 7.RK3588_DDR_Controler (U8.G12), 18.LPDDR4_LPDDR4x_2 (U10.H2)
DDR_CH1_A0_D: 7.RK3588_DDR_Controler (U8.H15), 18.LPDDR4_LPDDR4x_2 (U10.R2)
DDR_CH1_A1_C: 7.RK3588_DDR_Controler (U8.F12), 18.LPDDR4_LPDDR4x_2 (U10.J2)
DDR_CH1_A1_D: 7.RK3588_DDR_Controler (U8.G14), 18.LPDDR4_LPDDR4x_2 (U10.P2)
DDR_CH1_A2_C: 7.RK3588_DDR_Controler (U8.E13), 18.LPDDR4_LPDDR4x_2 (U10.H9)
DDR_CH1_A2_D: 7.RK3588_DDR_Controler (U8.G13), 18.LPDDR4_LPDDR4x_2 (U10.R9)
DDR_CH1_A3_C: 7.RK3588_DDR_Controler (U8.D13), 18.LPDDR4_LPDDR4x_2 (U10.H10)
DDR_CH1_A3_D: 7.RK3588_DDR_Controler (U8.E14), 18.LPDDR4_LPDDR4x_2 (U10.R10)
DDR_CH1_A4_C: 7.RK3588_DDR_Controler (U8.A10), 18.LPDDR4_LPDDR4x_2 (U10.H11)
DDR_CH1_A4_D: 7.RK3588_DDR_Controler (U8.A15), 18.LPDDR4_LPDDR4x_2 (U10.R11)
DDR_CH1_A5_C: 7.RK3588_DDR_Controler (U8.B11), 18.LPDDR4_LPDDR4x_2 (U10.J11)
DDR_CH1_A5_D: 7.RK3588_DDR_Controler (U8.B14), 18.LPDDR4_LPDDR4x_2 (U10.P11)
DDR_CH1_CLKN_C: 7.RK3588_DDR_Controler (U8.A12), 18.LPDDR4_LPDDR4x_2 (U10.J9)
DDR_CH1_CLKN_D: 7.RK3588_DDR_Controler (U8.A13), 18.LPDDR4_LPDDR4x_2 (U10.P9)
DDR_CH1_CLKP_C: 7.RK3588_DDR_Controler (U8.B12), 18.LPDDR4_LPDDR4x_2 (U10.J8)
DDR_CH1_CLKP_D: 7.RK3588_DDR_Controler (U8.B13), 18.LPDDR4_LPDDR4x_2 (U10.P8)
DDR_CH1_DM0_C: 7.RK3588_DDR_Controler (U8.F8), 18.LPDDR4_LPDDR4x_2 (U10.C3)
DDR_CH1_DM0_D: 7.RK3588_DDR_Controler (U8.D20), 18.LPDDR4_LPDDR4x_2 (U10.Y3)
DDR_CH1_DM1_C: 7.RK3588_DDR_Controler (U8.D4), 18.LPDDR4_LPDDR4x_2 (U10.C10)
DDR_CH1_DM1_D: 7.RK3588_DDR_Controler (U8.D22), 18.LPDDR4_LPDDR4x_2 (U10.Y10)
DDR_CH1_DQ0_C: 7.RK3588_DDR_Controler (U8.A8), 18.LPDDR4_LPDDR4x_2 (U10.B2)
DDR_CH1_DQ0_D: 7.RK3588_DDR_Controler (U8.A17), 18.LPDDR4_LPDDR4x_2 (U10.AA2)
DDR_CH1_DQ1_C: 7.RK3588_DDR_Controler (U8.B9), 18.LPDDR4_LPDDR4x_2 (U10.C2)
DDR_CH1_DQ1_D: 7.RK3588_DDR_Controler (U8.B16), 18.LPDDR4_LPDDR4x_2 (U10.Y2)
DDR_CH1_DQ2_C: 7.RK3588_DDR_Controler (U8.A9), 18.LPDDR4_LPDDR4x_2 (U10.E2)
DDR_CH1_DQ2_D: 7.RK3588_DDR_Controler (U8.A16), 18.LPDDR4_LPDDR4x_2 (U10.V2)
DDR_CH1_DQ3_C: 7.RK3588_DDR_Controler (U8.B10), 18.LPDDR4_LPDDR4x_2 (U10.F2)
DDR_CH1_DQ3_D: 7.RK3588_DDR_Controler (U8.B15), 18.LPDDR4_LPDDR4x_2 (U10.U2)
DDR_CH1_DQ4_C: 7.RK3588_DDR_Controler (U8.A6), 18.LPDDR4_LPDDR4x_2 (U10.F4)
DDR_CH1_DQ4_D: 7.RK3588_DDR_Controler (U8.A19), 18.LPDDR4_LPDDR4x_2 (U10.U4)
DDR_CH1_DQ5_C: 7.RK3588_DDR_Controler (U8.B7), 18.LPDDR4_LPDDR4x_2 (U10.E4)
DDR_CH1_DQ5_D: 7.RK3588_DDR_Controler (U8.B18), 18.LPDDR4_LPDDR4x_2 (U10.V4)
DDR_CH1_DQ6_C: 7.RK3588_DDR_Controler (U8.A7), 18.LPDDR4_LPDDR4x_2 (U10.C4)
DDR_CH1_DQ6_D: 7.RK3588_DDR_Controler (U8.A18), 18.LPDDR4_LPDDR4x_2 (U10.Y4)
DDR_CH1_DQ7_C: 7.RK3588_DDR_Controler (U8.B8), 18.LPDDR4_LPDDR4x_2 (U10.B4)
DDR_CH1_DQ7_D: 7.RK3588_DDR_Controler (U8.B17), 18.LPDDR4_LPDDR4x_2 (U10.AA4)
DDR_CH1_DQ8_C: 7.RK3588_DDR_Controler (U8.A3), 18.LPDDR4_LPDDR4x_2 (U10.B11)
DDR_CH1_DQ8_D: 7.RK3588_DDR_Controler (U8.A22), 18.LPDDR4_LPDDR4x_2 (U10.AA11)
DDR_CH1_DQ9_C: 7.RK3588_DDR_Controler (U8.B3), 18.LPDDR4_LPDDR4x_2 (U10.C11)
DDR_CH1_DQ9_D: 7.RK3588_DDR_Controler (U8.B22), 18.LPDDR4_LPDDR4x_2 (U10.Y11)
DDR_CH1_DQ10_C: 7.RK3588_DDR_Controler (U8.A2), 18.LPDDR4_LPDDR4x_2 (U10.E11)
DDR_CH1_DQ10_D: 7.RK3588_DDR_Controler (U8.A23), 18.LPDDR4_LPDDR4x_2 (U10.V11)
DDR_CH1_DQ11_C: 7.RK3588_DDR_Controler (U8.B2), 18.LPDDR4_LPDDR4x_2 (U10.F11)
DDR_CH1_DQ11_D: 7.RK3588_DDR_Controler (U8.B23), 18.LPDDR4_LPDDR4x_2 (U10.U11)
DDR_CH1_DQ12_C: 7.RK3588_DDR_Controler (U8.A5), 18.LPDDR4_LPDDR4x_2 (U10.F9)
DDR_CH1_DQ12_D: 7.RK3588_DDR_Controler (U8.A20), 18.LPDDR4_LPDDR4x_2 (U10.U9)
DDR_CH1_DQ13_C: 7.RK3588_DDR_Controler (U8.B5), 18.LPDDR4_LPDDR4x_2 (U10.E9)
DDR_CH1_DQ13_D: 7.RK3588_DDR_Controler (U8.B20), 18.LPDDR4_LPDDR4x_2 (U10.V9)
DDR_CH1_DQ14_C: 7.RK3588_DDR_Controler (U8.A4), 18.LPDDR4_LPDDR4x_2 (U10.C9)
DDR_CH1_DQ14_D: 7.RK3588_DDR_Controler (U8.A21), 18.LPDDR4_LPDDR4x_2 (U10.Y9)
DDR_CH1_DQ15_C: 7.RK3588_DDR_Controler (U8.B4), 18.LPDDR4_LPDDR4x_2 (U10.B9)
DDR_CH1_DQ15_D: 7.RK3588_DDR_Controler (U8.B21), 18.LPDDR4_LPDDR4x_2 (U10.AA9)
DDR_CH1_DQS0N_C: 7.RK3588_DDR_Controler (U8.D9), 18.LPDDR4_LPDDR4x_2 (U10.E3)
DDR_CH1_DQS0N_D: 7.RK3588_DDR_Controler (U8.G16), 18.LPDDR4_LPDDR4x_2 (U10.V3)
DDR_CH1_DQS0P_C: 7.RK3588_DDR_Controler (U8.E9), 18.LPDDR4_LPDDR4x_2 (U10.D3)
DDR_CH1_DQS0P_D: 7.RK3588_DDR_Controler (U8.H16), 18.LPDDR4_LPDDR4x_2 (U10.W3)
DDR_CH1_DQS1N_C: 7.RK3588_DDR_Controler (U8.D5), 18.LPDDR4_LPDDR4x_2 (U10.E10)
DDR_CH1_DQS1N_D: 7.RK3588_DDR_Controler (U8.E21), 18.LPDDR4_LPDDR4x_2 (U10.V10)
DDR_CH1_DQS1P_C: 7.RK3588_DDR_Controler (U8.E5), 18.LPDDR4_LPDDR4x_2 (U10.D10)
DDR_CH1_DQS1P_D: 7.RK3588_DDR_Controler (U8.D21), 18.LPDDR4_LPDDR4x_2 (U10.W10)
DDR_CH1_LP4/4X_CKE0_C: 7.RK3588_DDR_Controler (U8.D11), 18.LPDDR4_LPDDR4x_2 (R97.1)
DDR_CH1_LP4/4X_CKE0_D: 7.RK3588_DDR_Controler (U8.D16), 18.LPDDR4_LPDDR4x_2 (R98.1)
DDR_CH1_LP4/4X_CKE1_C: 7.RK3588_DDR_Controler (U8.E11), 18.LPDDR4_LPDDR4x_2 (R99.1)
DDR_CH1_LP4/4X_CKE1_D: 7.RK3588_DDR_Controler (U8.E16), 18.LPDDR4_LPDDR4x_2 (R100.1)
DDR_CH1_LP4/4X_CS0_C: 7.RK3588_DDR_Controler (U8.G11), 18.LPDDR4_LPDDR4x_2 (U10.H4)
DDR_CH1_LP4/4X_CS0_D: 7.RK3588_DDR_Controler (U8.E19), 18.LPDDR4_LPDDR4x_2 (U10.R4)
DDR_CH1_LP4/4X_CS1_C: 7.RK3588_DDR_Controler (U8.H11), 18.LPDDR4_LPDDR4x_2 (U10.H3)
DDR_CH1_LP4/4X_CS1_D: 7.RK3588_DDR_Controler (U8.D19), 18.LPDDR4_LPDDR4x_2 (U10.R3)
DDR_RESET: 7.RK3588_DDR_Controler (U8.T4), 17.LPDDR4_LPDDR4x_1 (C306.2 U9.T11), 18.LPDDR4_LPDDR4x_2 (C350.2 U10.T11)
EMMC_CLKOUT: 8.RK3588_EMMCIO_VCCIO2 (R51.2), 19.EMMC_FLASH (C395.2 U11.M6)
EMMC_D4: 8.RK3588_EMMCIO_VCCIO2 (U8.Y32), 19.EMMC_FLASH (U11.B3)
EMMC_D5: 8.RK3588_EMMCIO_VCCIO2 (U8.AA32), 19.EMMC_FLASH (U11.B4)
EMMC_D7: 8.RK3588_EMMCIO_VCCIO2 (U8.V33), 19.EMMC_FLASH (U11.B6)
EMMC_DATA_STROBE: 8.RK3588_EMMCIO_VCCIO2 (U8.Y34), 19.EMMC_FLASH (R108.2 R118.1)
EMMC_RSTN: 8.RK3588_EMMCIO_VCCIO2 (R52.2), 19.EMMC_FLASH (C394.2 R107.2 U11.K5)
EXT_PWR_EN: 1.PMIC_1 (U1.39), 2.PMIC_2 (R26.2), 20.BTB (BTB_1.83)
FSPI_CLK_M0: 8.RK3588_EMMCIO_VCCIO2 (U8.W34), 19.EMMC_FLASH (R106.2 R119.2 U11.M5)
FSPI_CS0N_M0: 8.RK3588_EMMCIO_VCCIO2 (U8.W32), 19.EMMC_FLASH (U11.B5 U12.1)
FSPI_D0_M0: 8.RK3588_EMMCIO_VCCIO2 (U8.Y33), 19.EMMC_FLASH (R105.2 U11.A3 U12.5)
FSPI_D1_M0: 8.RK3588_EMMCIO_VCCIO2 (U8.W33), 19.EMMC_FLASH (U11.A4 U12.2)
FSPI_D2_M0: 8.RK3588_EMMCIO_VCCIO2 (U8.V32), 19.EMMC_FLASH (R110.2 U11.A5 U12.3)
FSPI_D3_M0: 8.RK3588_EMMCIO_VCCIO2 (U8.AA33), 19.EMMC_FLASH (R109.2 U11.B2 U12.7)
GMAC0_MCLKINOUT: 10.RK3588_VCCIO1_VCCIO3_SARADC (R115.2), 20.BTB (BTB_1.63)
GMAC0_MDC: 10.RK3588_VCCIO1_VCCIO3_SARADC (R116.2), 20.BTB (BTB_1.55)
GMAC0_MDIO: 10.RK3588_VCCIO1_VCCIO3_SARADC (R117.2), 20.BTB (BTB_1.54)
GMAC0_RXCLK: 10.RK3588_VCCIO1_VCCIO3_SARADC (U8.AE32), 20.BTB (BTB_1.38)
GMAC0_RXD0: 10.RK3588_VCCIO1_VCCIO3_SARADC (U8.AD32), 20.BTB (BTB_1.40)
GMAC0_RXD1: 10.RK3588_VCCIO1_VCCIO3_SARADC (U8.AD31), 20.BTB (BTB_1.39)
GMAC0_RXD2: 10.RK3588_VCCIO1_VCCIO3_SARADC (U8.AC32), 20.BTB (BTB_1.42)
GMAC0_RXD3: 10.RK3588_VCCIO1_VCCIO3_SARADC (U8.AC31), 20.BTB (BTB_1.41)
GMAC0_RXDV_CRS: 10.RK3588_VCCIO1_VCCIO3_SARADC (U8.AE31), 20.BTB (BTB_1.37)
GMAC0_TXCLK: 10.RK3588_VCCIO1_VCCIO3_SARADC (R111.2), 20.BTB (BTB_1.61)
GMAC0_TXD0: 10.RK3588_VCCIO1_VCCIO3_SARADC (R112.2), 20.BTB (BTB_1.59)
GMAC0_TXD1: 10.RK3588_VCCIO1_VCCIO3_SARADC (R113.2), 20.BTB (BTB_1.60)
GMAC0_TXD2: 10.RK3588_VCCIO1_VCCIO3_SARADC (R101.2), 20.BTB (BTB_1.57)
GMAC0_TXD3: 10.RK3588_VCCIO1_VCCIO3_SARADC (R102.2), 20.BTB (BTB_1.58)
GMAC0_TXEN: 10.RK3588_VCCIO1_VCCIO3_SARADC (R114.2), 20.BTB (BTB_1.62)
GPIO0_A0: 5.RK3588_OSC_PLL_PMUIO1 (U8.P33), 20.BTB (BTB_3.3)
GPIO0_B2: 5.RK3588_OSC_PLL_PMUIO1 (U8.K29), 20.BTB (BTB_3.19)
GPIO0_B7: 6.RK3588_PMUIO2 (U8.T28), 20.BTB (BTB_3.18)
GPIO0_C6: 6.RK3588_PMUIO2 (U8.T29), 20.BTB (BTB_3.16)
GPIO0_C7: 6.RK3588_PMUIO2 (U8.V31), 20.BTB (BTB_3.15)
GPIO0_D3: 6.RK3588_PMUIO2 (U8.U33), 20.BTB (BTB_1.53)
GPIO1_A2: 14.RK3588_VCCIO4 (U8.A26), 20.BTB (BTB_3.55)
GPIO1_A4: 14.RK3588_VCCIO4 (U8.B25), 20.BTB (BTB_3.54)
GPIO1_A7: 14.RK3588_VCCIO4 (U8.C25), 20.BTB (BTB_3.46)
GPIO1_B0: 14.RK3588_VCCIO4 (U8.C27), 20.BTB (BTB_3.42)
GPIO1_B1: 14.RK3588_VCCIO4 (U8.D25), 20.BTB (BTB_3.47)
GPIO1_C0: 10.RK3588_VCCIO1_VCCIO3_SARADC (U8.G29), 20.BTB (BTB_3.32)
GPIO1_C1: 10.RK3588_VCCIO1_VCCIO3_SARADC (U8.G27), 20.BTB (BTB_3.30)
GPIO1_C4: 10.RK3588_VCCIO1_VCCIO3_SARADC (U8.E30), 20.BTB (BTB_3.35)
GPIO1_C6: 10.RK3588_VCCIO1_VCCIO3_SARADC (U8.D29), 20.BTB (BTB_3.39), 21.RK3588_CONFIG (R49.1)
GPIO1_D3: 10.RK3588_VCCIO1_VCCIO3_SARADC (U8.E28), 20.BTB (BTB_3.40)
GPIO1_D5: 10.RK3588_VCCIO1_VCCIO3_SARADC (U8.G26), 20.BTB (BTB_3.29)
GPIO2_C5: 10.RK3588_VCCIO1_VCCIO3_SARADC (U8.AE30), 20.BTB (BTB_3.8)
GPIO3_A6: 15.RK3588_VCCIO5 (U8.AH27), 20.BTB (BTB_2.89)
GPIO3_B2: 15.RK3588_VCCIO5 (U8.AE28), 20.BTB (BTB_3.4)
GPIO3_C0: 15.RK3588_VCCIO5 (U8.Y29), 20.BTB (BTB_1.46)
GPIO3_D5: 15.RK3588_VCCIO5 (U8.AB28), 20.BTB (BTB_3.5)
GPIO4_A3: 16.RK3588_VCCIO6 (U8.AL29), 20.BTB (BTB_2.81)
GPIO4_B1: 16.RK3588_VCCIO6 (U8.AL24), 20.BTB (BTB_2.65)
GPIO4_C6: 10.RK3588_VCCIO1_VCCIO3_SARADC (U8.AF33), 20.BTB (BTB_1.65)
HDMI_TX0_CEC_M0: 16.RK3588_VCCIO6 (U8.AK24), 20.BTB (BTB_2.66)
HDMI_TX0_D0N: 12.RK3588_MIPI_CSI_HDMI2.1_HDMI (U8.AJ1), 20.BTB (BTB_4.37)
HDMI_TX0_D0P: 12.RK3588_MIPI_CSI_HDMI2.1_HDMI (U8.AJ2), 20.BTB (BTB_4.36)
HDMI_TX0_D1N: 12.RK3588_MIPI_CSI_HDMI2.1_HDMI (U8.AK2), 20.BTB (BTB_4.35)
HDMI_TX0_D1P: 12.RK3588_MIPI_CSI_HDMI2.1_HDMI (U8.AK3), 20.BTB (BTB_4.34)
HDMI_TX0_D2N: 12.RK3588_MIPI_CSI_HDMI2.1_HDMI (U8.AL1), 20.BTB (BTB_4.33)
HDMI_TX0_D2P: 12.RK3588_MIPI_CSI_HDMI2.1_HDMI (U8.AL2), 20.BTB (BTB_4.32)
HDMI_TX0_D3N: 12.RK3588_MIPI_CSI_HDMI2.1_HDMI (U8.AH2), 20.BTB (BTB_4.39)
HDMI_TX0_D3P: 12.RK3588_MIPI_CSI_HDMI2.1_HDMI (U8.AH3), 20.BTB (BTB_4.38)
HDMI_TX0_HPD_M0: 14.RK3588_VCCIO4 (U8.B26), 20.BTB (BTB_3.56)
HDMI_TX0_SBDN: 12.RK3588_MIPI_CSI_HDMI2.1_HDMI (U8.AG1), 20.BTB (BTB_4.42)
HDMI_TX0_SBDP: 12.RK3588_MIPI_CSI_HDMI2.1_HDMI (U8.AG2), 20.BTB (BTB_4.41)
HDMI_TX0_SCL_M0: 16.RK3588_VCCIO6 (U8.AJ28), 20.BTB (BTB_2.79)
HDMI_TX0_SDA_M0: 16.RK3588_VCCIO6 (U8.AJ25), 20.BTB (BTB_2.88)
HDMI_TX1_CEC_M0: 10.RK3588_VCCIO1_VCCIO3_SARADC (U8.AC30), 20.BTB (BTB_3.7)
HDMI_TX1_D0N: 12.RK3588_MIPI_CSI_HDMI2.1_HDMI (U8.AP4), 20.BTB (BTB_4.25)
HDMI_TX1_D0P: 12.RK3588_MIPI_CSI_HDMI2.1_HDMI (U8.AN4), 20.BTB (BTB_4.24)
HDMI_TX1_D1N: 12.RK3588_MIPI_CSI_HDMI2.1_HDMI (U8.AN5), 20.BTB (BTB_4.23)
HDMI_TX1_D1P: 12.RK3588_MIPI_CSI_HDMI2.1_HDMI (U8.AM5), 20.BTB (BTB_4.22)
HDMI_TX1_D2N: 12.RK3588_MIPI_CSI_HDMI2.1_HDMI (U8.AP6), 20.BTB (BTB_4.21)
HDMI_TX1_D2P: 12.RK3588_MIPI_CSI_HDMI2.1_HDMI (U8.AN6), 20.BTB (BTB_4.20)
HDMI_TX1_D3N: 12.RK3588_MIPI_CSI_HDMI2.1_HDMI (U8.AN3), 20.BTB (BTB_4.27)
HDMI_TX1_D3P: 12.RK3588_MIPI_CSI_HDMI2.1_HDMI (U8.AM3), 20.BTB (BTB_4.26)
HDMI_TX1_HPD_M0: 14.RK3588_VCCIO4 (U8.C24), 20.BTB (BTB_3.48)
HDMI_TX1_SBDN: 12.RK3588_MIPI_CSI_HDMI2.1_HDMI (U8.AP2), 20.BTB (BTB_4.30)
HDMI_TX1_SBDP: 12.RK3588_MIPI_CSI_HDMI2.1_HDMI (U8.AN2), 20.BTB (BTB_4.29)
HDMI_TX1_SCL_M0: 10.RK3588_VCCIO1_VCCIO3_SARADC (U8.AB30), 20.BTB (BTB_1.45)
HDMI_TX1_SDA_M0: 10.RK3588_VCCIO1_VCCIO3_SARADC (U8.AB31), 20.BTB (BTB_1.44)
I2C0_SCL_M2: 2.PMIC_2 (U3.A3 U5.A3), 6.RK3588_PMUIO2 (R44.2 U8.W30), 20.BTB (BTB_1.47)
I2C0_SDA_M2: 2.PMIC_2 (U3.B1 U5.B1), 6.RK3588_PMUIO2 (R43.2 U8.W29), 20.BTB (BTB_3.12)
I2C1_SCL_M2: 2.PMIC_2 (U6.A3), 6.RK3588_PMUIO2 (R41.2 U8.V29), 20.BTB (BTB_3.13)
I2C1_SDA_M2: 2.PMIC_2 (U6.B1), 6.RK3588_PMUIO2 (R39.2 U8.V28), 20.BTB (BTB_3.11)
I2C2_SCL_M4: 14.RK3588_VCCIO4 (U8.A25), 20.BTB (BTB_3.53)
I2C2_SDA_M4: 14.RK3588_VCCIO4 (U8.A24), 20.BTB (BTB_3.52)
I2C5_SCL_M3: 14.RK3588_VCCIO4 (U8.E26), 20.BTB (BTB_3.24)
I2C5_SDA_M3: 14.RK3588_VCCIO4 (U8.E27), 20.BTB (BTB_3.44)
I2C7_SCL_M0: 10.RK3588_VCCIO1_VCCIO3_SARADC (U8.F26), 20.BTB (BTB_3.23)
I2C7_SDA_M0: 10.RK3588_VCCIO1_VCCIO3_SARADC (U8.F27), 20.BTB (BTB_3.31)
I2C8_SCL_M2: 14.RK3588_VCCIO4 (U8.F24), 20.BTB (BTB_3.21)
I2C8_SDA_M2: 14.RK3588_VCCIO4 (U8.F25), 20.BTB (BTB_3.22)
I2S0_LRCK: 10.RK3588_VCCIO1_VCCIO3_SARADC (U8.D30), 20.BTB (BTB_3.38)
I2S0_MCLK: 10.RK3588_VCCIO1_VCCIO3_SARADC (U8.F30), 20.BTB (BTB_3.34)
I2S0_SCLK: 10.RK3588_VCCIO1_VCCIO3_SARADC (U8.E31), 20.BTB (BTB_3.36)
I2S0_SDI0: 10.RK3588_VCCIO1_VCCIO3_SARADC (U8.D28), 20.BTB (BTB_3.41)
I2S0_SDO0: 10.RK3588_VCCIO1_VCCIO3_SARADC (U8.E29), 20.BTB (BTB_3.37)
MIPI_DPHY0_RX_CLKN: 11.RK3588_MIPI_D_C_PHY0_1 (U8.AP31), 20.BTB (BTB_2.13)
MIPI_DPHY0_RX_CLKP: 11.RK3588_MIPI_D_C_PHY0_1 (U8.AN32), 20.BTB (BTB_2.12)
MIPI_DPHY0_RX_D0N: 11.RK3588_MIPI_D_C_PHY0_1 (U8.AP29), 20.BTB (BTB_2.17)
MIPI_DPHY0_RX_D0P: 11.RK3588_MIPI_D_C_PHY0_1 (U8.AN29), 20.BTB (BTB_2.18)
MIPI_DPHY0_RX_D1N: 11.RK3588_MIPI_D_C_PHY0_1 (U8.AP30), 20.BTB (BTB_2.15)
MIPI_DPHY0_RX_D1P: 11.RK3588_MIPI_D_C_PHY0_1 (U8.AN30), 20.BTB (BTB_2.16)
MIPI_DPHY0_RX_D2N: 11.RK3588_MIPI_D_C_PHY0_1 (U8.AP32), 20.BTB (BTB_2.10)
MIPI_DPHY0_RX_D2P: 11.RK3588_MIPI_D_C_PHY0_1 (U8.AN33), 20.BTB (BTB_2.9)
MIPI_DPHY0_RX_D3N: 11.RK3588_MIPI_D_C_PHY0_1 (U8.AP33), 20.BTB (BTB_2.8)
MIPI_DPHY0_RX_D3P: 11.RK3588_MIPI_D_C_PHY0_1 (U8.AN34), 20.BTB (BTB_2.7)
MIPI_DPHY0_TX_CLKN: 11.RK3588_MIPI_D_C_PHY0_1 (U8.AP26), 20.BTB (BTB_2.25)
MIPI_DPHY0_TX_CLKP: 11.RK3588_MIPI_D_C_PHY0_1 (U8.AN26), 20.BTB (BTB_2.26)
MIPI_DPHY0_TX_D0N: 11.RK3588_MIPI_D_C_PHY0_1 (U8.AP24), 20.BTB (BTB_2.30)
MIPI_DPHY0_TX_D0P: 11.RK3588_MIPI_D_C_PHY0_1 (U8.AN24), 20.BTB (BTB_2.31)
MIPI_DPHY0_TX_D1N: 11.RK3588_MIPI_D_C_PHY0_1 (U8.AP25), 20.BTB (BTB_2.28)
MIPI_DPHY0_TX_D1P: 11.RK3588_MIPI_D_C_PHY0_1 (U8.AN25), 20.BTB (BTB_2.29)
MIPI_DPHY0_TX_D2N: 11.RK3588_MIPI_D_C_PHY0_1 (U8.AP27), 20.BTB (BTB_2.22)
MIPI_DPHY0_TX_D2P: 11.RK3588_MIPI_D_C_PHY0_1 (U8.AN27), 20.BTB (BTB_2.23)
MIPI_DPHY0_TX_D3N: 11.RK3588_MIPI_D_C_PHY0_1 (U8.AP28), 20.BTB (BTB_2.20)
MIPI_DPHY0_TX_D3P: 11.RK3588_MIPI_D_C_PHY0_1 (U8.AN28), 20.BTB (BTB_2.21)
NPU_VSEL: 2.PMIC_2 (U6.A1), 6.RK3588_PMUIO2 (U8.U32)
PCIE20_0_REFCLKN: 13.RK3588_PCIE2.0_PCIE3.0 (U8.L33), 20.BTB (BTB_3.93)
PCIE20_0_REFCLKP: 13.RK3588_PCIE2.0_PCIE3.0 (U8.L32), 20.BTB (BTB_3.92)
PCIE20_0_RXN: 13.RK3588_PCIE2.0_PCIE3.0 (U8.N34), 20.BTB (BTB_3.98)
PCIE20_0_RXP: 13.RK3588_PCIE2.0_PCIE3.0 (U8.N33), 20.BTB (BTB_3.97)
PCIE20_0_TXN: 13.RK3588_PCIE2.0_PCIE3.0 (U8.M33), 20.BTB (BTB_3.95)
PCIE20_0_TXP: 13.RK3588_PCIE2.0_PCIE3.0 (U8.M34), 20.BTB (BTB_3.96)
PCIE20_1_REFCLKN: 13.RK3588_PCIE2.0_PCIE3.0 (U8.H33), 20.BTB (BTB_3.85)
PCIE20_1_REFCLKP: 13.RK3588_PCIE2.0_PCIE3.0 (U8.H32), 20.BTB (BTB_3.84)
PCIE20_1_RXN: 13.RK3588_PCIE2.0_PCIE3.0 (U8.J34), 20.BTB (BTB_3.88)
PCIE20_1_RXP: 13.RK3588_PCIE2.0_PCIE3.0 (U8.J33), 20.BTB (BTB_3.87)
PCIE20_1_TXN: 13.RK3588_PCIE2.0_PCIE3.0 (U8.K34), 20.BTB (BTB_3.90)
PCIE20_1_TXP: 13.RK3588_PCIE2.0_PCIE3.0 (U8.K33), 20.BTB (BTB_3.89)
PCIE30_PORT0_REF_CLKN: 13.RK3588_PCIE2.0_PCIE3.0 (U8.E34), 20.BTB (BTB_3.77), 21.RK3588_CONFIG (R121.2)
PCIE30_PORT0_REF_CLKP: 13.RK3588_PCIE2.0_PCIE3.0 (U8.E33), 20.BTB (BTB_3.76), 21.RK3588_CONFIG (R120.2)
PCIE30_PORT0_RX0N: 13.RK3588_PCIE2.0_PCIE3.0 (U8.G34), 20.BTB (BTB_3.82)
PCIE30_PORT0_RX0P: 13.RK3588_PCIE2.0_PCIE3.0 (U8.G33), 20.BTB (BTB_3.81)
PCIE30_PORT0_RX1N: 13.RK3588_PCIE2.0_PCIE3.0 (U8.F33), 20.BTB (BTB_3.80)
PCIE30_PORT0_RX1P: 13.RK3588_PCIE2.0_PCIE3.0 (U8.F32), 20.BTB (BTB_3.79)
PCIE30_PORT0_TX0N: 13.RK3588_PCIE2.0_PCIE3.0 (U8.D33), 20.BTB (BTB_3.74)
PCIE30_PORT0_TX0P: 13.RK3588_PCIE2.0_PCIE3.0 (U8.D32), 20.BTB (BTB_3.73)
PCIE30_PORT0_TX1N: 13.RK3588_PCIE2.0_PCIE3.0 (U8.C34), 20.BTB (BTB_3.72)
PCIE30_PORT0_TX1P: 13.RK3588_PCIE2.0_PCIE3.0 (U8.C33), 20.BTB (BTB_3.71)
PCIE30_PORT1_REF_CLKN: 13.RK3588_PCIE2.0_PCIE3.0 (U8.B28), 20.BTB (BTB_3.59), 21.RK3588_CONFIG (R125.2)
PCIE30_PORT1_REF_CLKP: 13.RK3588_PCIE2.0_PCIE3.0 (U8.A28), 20.BTB (BTB_3.60), 21.RK3588_CONFIG (R124.2)
PCIE30_PORT1_RX0N: 13.RK3588_PCIE2.0_PCIE3.0 (U8.A32), 20.BTB (BTB_3.69)
PCIE30_PORT1_RX0P: 13.RK3588_PCIE2.0_PCIE3.0 (U8.B32), 20.BTB (BTB_3.68)
PCIE30_PORT1_RX1N: 13.RK3588_PCIE2.0_PCIE3.0 (U8.B31), 20.BTB (BTB_3.67)
PCIE30_PORT1_RX1P: 13.RK3588_PCIE2.0_PCIE3.0 (U8.C31), 20.BTB (BTB_3.66)
PCIE30_PORT1_TX0N: 13.RK3588_PCIE2.0_PCIE3.0 (U8.A30), 20.BTB (BTB_3.65)
PCIE30_PORT1_TX0P: 13.RK3588_PCIE2.0_PCIE3.0 (U8.B30), 20.BTB (BTB_3.64)
PCIE30_PORT1_TX1N: 13.RK3588_PCIE2.0_PCIE3.0 (U8.B29), 20.BTB (BTB_3.63)
PCIE30_PORT1_TX1P: 13.RK3588_PCIE2.0_PCIE3.0 (U8.C29), 20.BTB (BTB_3.62)
PCIE30X1_0_CLKREQN_M0: 6.RK3588_PMUIO2 (U8.T31), 20.BTB (BTB_1.49)
PCIE30X1_0_PERSTN_M0: 6.RK3588_PMUIO2 (U8.P30), 20.BTB (BTB_3.27)
PCIE30X1_0_WAKEN_M0: 6.RK3588_PMUIO2 (U8.R30), 20.BTB (BTB_3.17)
PCIE30X2_CLKREQN_M1: 16.RK3588_VCCIO6 (U8.AL27), 20.BTB (BTB_2.73)
PCIE30X2_PERSTN_M1: 16.RK3588_VCCIO6 (U8.AK26), 20.BTB (BTB_2.75)
PCIE30X2_WAKEN_M1: 16.RK3588_VCCIO6 (U8.AM27), 20.BTB (BTB_2.74)
PCIE30X4_CLKREQN_M1: 16.RK3588_VCCIO6 (U8.AL26), 20.BTB (BTB_2.72)
PCIE30X4_PERSTN_M1: 16.RK3588_VCCIO6 (U8.AJ27), 20.BTB (BTB_2.77)
PCIE30X4_WAKEN_M1: 16.RK3588_VCCIO6 (U8.AJ26), 20.BTB (BTB_2.84)
PMIC_INT: 1.PMIC_1 (R14.2 U1.19), 5.RK3588_OSC_PLL_PMUIO1 (U8.M30)
PMIC_PWR_CTRL1: 1.PMIC_1 (U1.62), 5.RK3588_OSC_PLL_PMUIO1 (R32.2)
PMIC_PWR_CTRL2: 1.PMIC_1 (U1.61), 6.RK3588_PMUIO2 (R38.2 R42.2)
PMIC_PWR_CTRL3: 1.PMIC_1 (U1.16), 6.RK3588_PMUIO2 (R37.2 R40.2)
PMIC_SPI_CLK: 1.PMIC_1 (U1.17), 5.RK3588_OSC_PLL_PMUIO1 (R33.2)
PMIC_SPI_CS: 1.PMIC_1 (R13.2 U1.18), 5.RK3588_OSC_PLL_PMUIO1 (R35.2)
PMIC_SPI_MOSI: 1.PMIC_1 (R15.2 U1.15), 5.RK3588_OSC_PLL_PMUIO1 (R34.2 R36.2)
PWR_ON: 1.PMIC_1 (C64.2 U1.4), 20.BTB (BTB_1.84), 21.RK3588_CONFIG (R142.2)
RECOVERY_KEY: 10.RK3588_VCCIO1_VCCIO3_SARADC (C231.1 R60.1 U8.AL16), 20.BTB (BTB_4.84), 21.RK3588_CONFIG (R136.2)
RESETn: 1.PMIC_1 (R16.2 U1.40), 5.RK3588_OSC_PLL_PMUIO1 (C173.2 R31.1 U8.M31), 20.BTB (BTB_1.85), 21.RK3588_CONFIG (R138.2)
RTC_INT: 5.RK3588_OSC_PLL_PMUIO1 (U8.L30), 20.BTB (BTB_3.28)
SARADC_IN0_BOOT: 10.RK3588_VCCIO1_VCCIO3_SARADC (C230.1 R62.1 R64.2 U8.AM16), 20.BTB (BTB_4.85), 21.RK3588_CONFIG (R133.2)
SARADC_IN2: 10.RK3588_VCCIO1_VCCIO3_SARADC (C232.1 R61.1 R63.2 U8.AK16), 20.BTB (BTB_4.89)
SARADC_IN3: 10.RK3588_VCCIO1_VCCIO3_SARADC (C233.1 R6.1 R17.2 U8.AN17), 20.BTB (BTB_4.87)
SARADC_IN4: 10.RK3588_VCCIO1_VCCIO3_SARADC (C234.1 U8.AM17), 20.BTB (BTB_4.86)
SDMMC_CLK: 8.RK3588_EMMCIO_VCCIO2 (R53.2), 20.BTB (BTB_4.49), 21.RK3588_CONFIG (R139.1)
SDMMC_CMD: 8.RK3588_EMMCIO_VCCIO2 (U8.AE2), 20.BTB (BTB_4.46), 21.RK3588_CONFIG (R140.1)
SDMMC_D0: 8.RK3588_EMMCIO_VCCIO2 (U8.AD2), 20.BTB (BTB_4.47), 21.RK3588_CONFIG (R145.1)
SDMMC_D1: 8.RK3588_EMMCIO_VCCIO2 (U8.AD1), 20.BTB (BTB_4.48), 21.RK3588_CONFIG (R144.1)
SDMMC_D2: 8.RK3588_EMMCIO_VCCIO2 (U8.AF2), 20.BTB (BTB_4.44), 21.RK3588_CONFIG (R143.1)
SDMMC_D3: 8.RK3588_EMMCIO_VCCIO2 (U8.AF1), 20.BTB (BTB_4.45), 21.RK3588_CONFIG (R141.1)
SDMMC_DET: 5.RK3588_OSC_PLL_PMUIO1 (U8.P31), 20.BTB (BTB_3.26), 21.RK3588_CONFIG (R146.1 R147.1)
TYPEC0_SBU1: 9.RK3588_USB_Controler (U8.AL15), 20.BTB (BTB_4.81)
TYPEC0_SBU2: 9.RK3588_USB_Controler (U8.AM15), 20.BTB (BTB_4.82)
TYPEC0_SSRX1N: 9.RK3588_USB_Controler (U8.AP13), 20.BTB (BTB_4.7)
TYPEC0_SSRX1P: 9.RK3588_USB_Controler (U8.AN13), 20.BTB (BTB_4.8)
TYPEC0_SSRX2N: 9.RK3588_USB_Controler (U8.AP15), 20.BTB (BTB_2.48)
TYPEC0_SSRX2P: 9.RK3588_USB_Controler (U8.AN15), 20.BTB (BTB_2.49)
TYPEC0_SSTX1N: 9.RK3588_USB_Controler (U8.AN14), 20.BTB (BTB_4.6)
TYPEC0_SSTX1P: 9.RK3588_USB_Controler (U8.AP14), 20.BTB (BTB_4.5)
TYPEC0_SSTX2N: 9.RK3588_USB_Controler (U8.AN16), 20.BTB (BTB_2.47)
TYPEC0_SSTX2P: 9.RK3588_USB_Controler (U8.AP16), 20.BTB (BTB_2.46)
TYPEC0_USB20_OTG_DM: 9.RK3588_USB_Controler (U8.AM12), 20.BTB (BTB_4.77), 21.RK3588_CONFIG (R132.2)
TYPEC0_USB20_OTG_DP: 9.RK3588_USB_Controler (U8.AL12), 20.BTB (BTB_4.76), 21.RK3588_CONFIG (R130.2)
TYPEC0_USB20_OTG_ID: 9.RK3588_USB_Controler (U8.AL14), 20.BTB (BTB_4.79), 21.RK3588_CONFIG (R134.2)
TYPEC0_USB20_VBUSDET: 9.RK3588_USB_Controler (U8.AM14), 20.BTB (BTB_4.80), 21.RK3588_CONFIG (R135.2)
TYPEC1_SBU1: 9.RK3588_USB_Controler (U8.AL10), 20.BTB (BTB_4.72)
TYPEC1_SBU2: 9.RK3588_USB_Controler (U8.AM10), 20.BTB (BTB_4.73)
TYPEC1_SSRX1N: 9.RK3588_USB_Controler (U8.AP8), 20.BTB (BTB_4.18)
TYPEC1_SSRX1P: 9.RK3588_USB_Controler (U8.AN8), 20.BTB (BTB_4.17)
TYPEC1_SSRX2N: 9.RK3588_USB_Controler (U8.AP10), 20.BTB (BTB_4.13)
TYPEC1_SSRX2P: 9.RK3588_USB_Controler (U8.AN10), 20.BTB (BTB_4.12)
TYPEC1_SSTX1N: 9.RK3588_USB_Controler (U8.AN9), 20.BTB (BTB_4.15)
TYPEC1_SSTX1P: 9.RK3588_USB_Controler (U8.AP9), 20.BTB (BTB_4.16)
TYPEC1_SSTX2N: 9.RK3588_USB_Controler (U8.AN11), 20.BTB (BTB_4.10)
TYPEC1_SSTX2P: 9.RK3588_USB_Controler (U8.AP11), 20.BTB (BTB_4.11)
TYPEC1_USB20_OTG_DM: 9.RK3588_USB_Controler (U8.AL9), 20.BTB (BTB_4.70)
TYPEC1_USB20_OTG_DP: 9.RK3588_USB_Controler (U8.AK9), 20.BTB (BTB_4.69)
TYPEC1_USB20_OTG_ID: 9.RK3588_USB_Controler (U8.AK8), 20.BTB (BTB_4.74)
TYPEC1_USB20_VBUSDET: 9.RK3588_USB_Controler (U8.AL8), 20.BTB (BTB_4.67)
UART2_RX_M0_DEBUG: 6.RK3588_PMUIO2 (U8.R29), 20.BTB (BTB_1.48), 21.RK3588_CONFIG (R123.2)
UART2_TX_M0_DEBUG: 6.RK3588_PMUIO2 (U8.P29), 20.BTB (BTB_3.20), 21.RK3588_CONFIG (R127.2)
UART4_RX_M2: 14.RK3588_VCCIO4 (U8.D26), 20.BTB (BTB_3.45)
UART4_TX_M2: 14.RK3588_VCCIO4 (U8.D27), 20.BTB (BTB_3.43)
UART7_RX_M2: 14.RK3588_VCCIO4 (U8.E24), 20.BTB (BTB_3.25)
UART7_TX_M2: 14.RK3588_VCCIO4 (U8.E25), 20.BTB (BTB_3.49)
USB20_HOST0_DM: 9.RK3588_USB_Controler (U8.AL6), 20.BTB (BTB_4.62)
USB20_HOST0_DP: 9.RK3588_USB_Controler (U8.AK6), 20.BTB (BTB_4.61)
USB20_HOST1_DM: 9.RK3588_USB_Controler (U8.AM7), 20.BTB (BTB_4.65)
USB20_HOST1_DP: 9.RK3588_USB_Controler (U8.AL7), 20.BTB (BTB_4.64)